# EAGLE design menial_board_v2 (EAGLE 5.10)
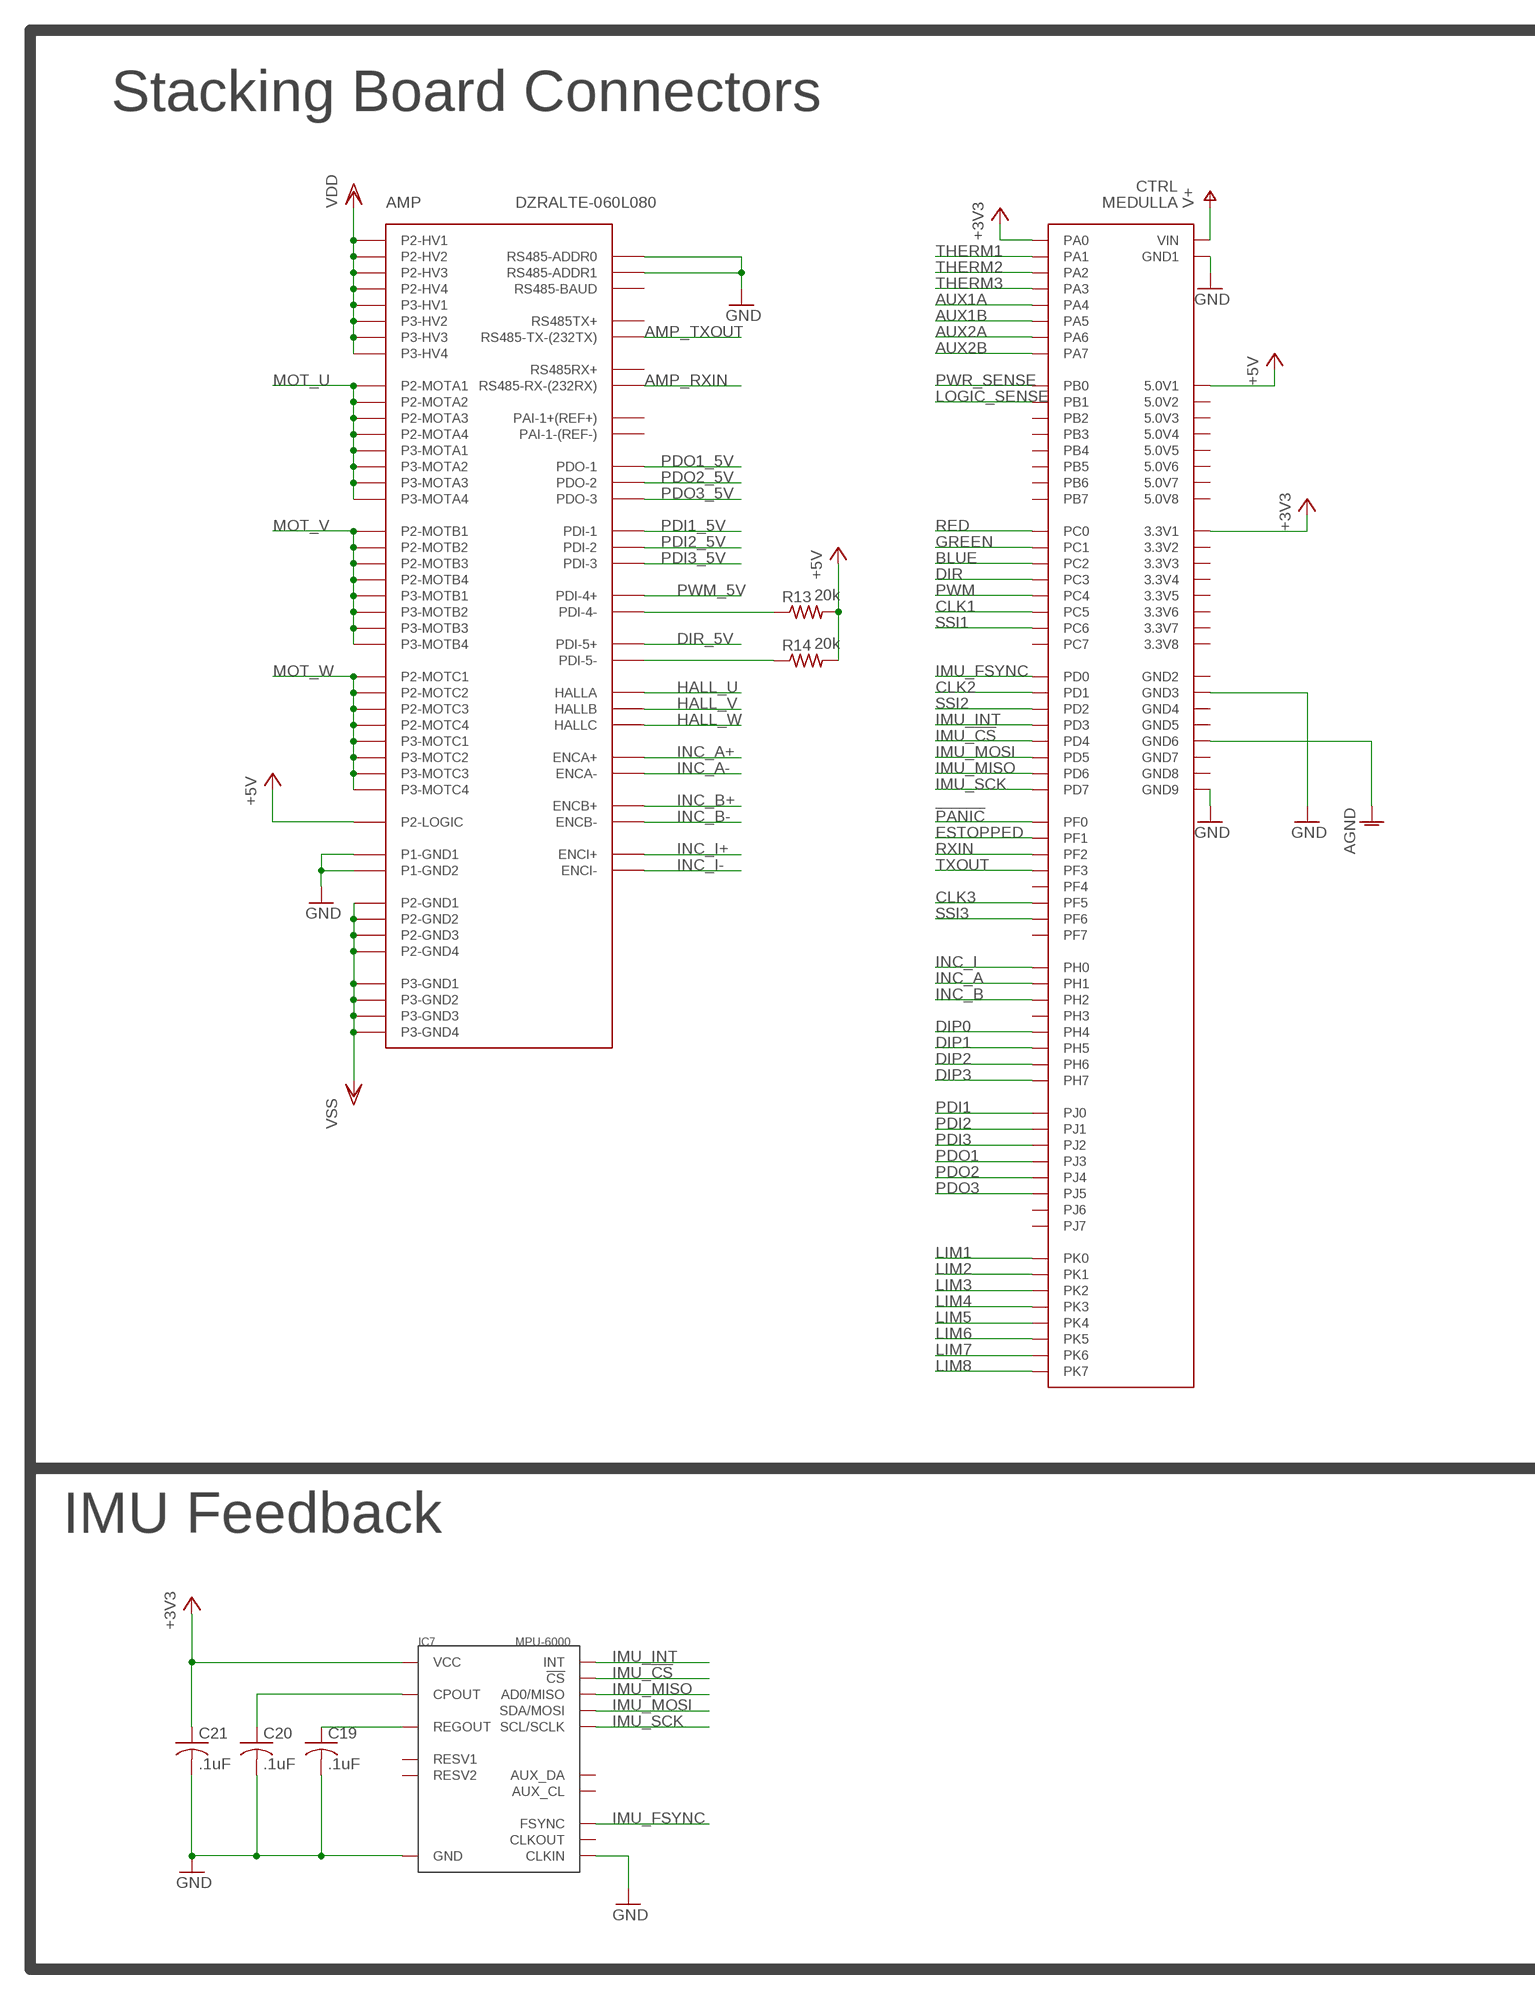
[diagram p0: schematic, sheet 1, part 1 of 2]
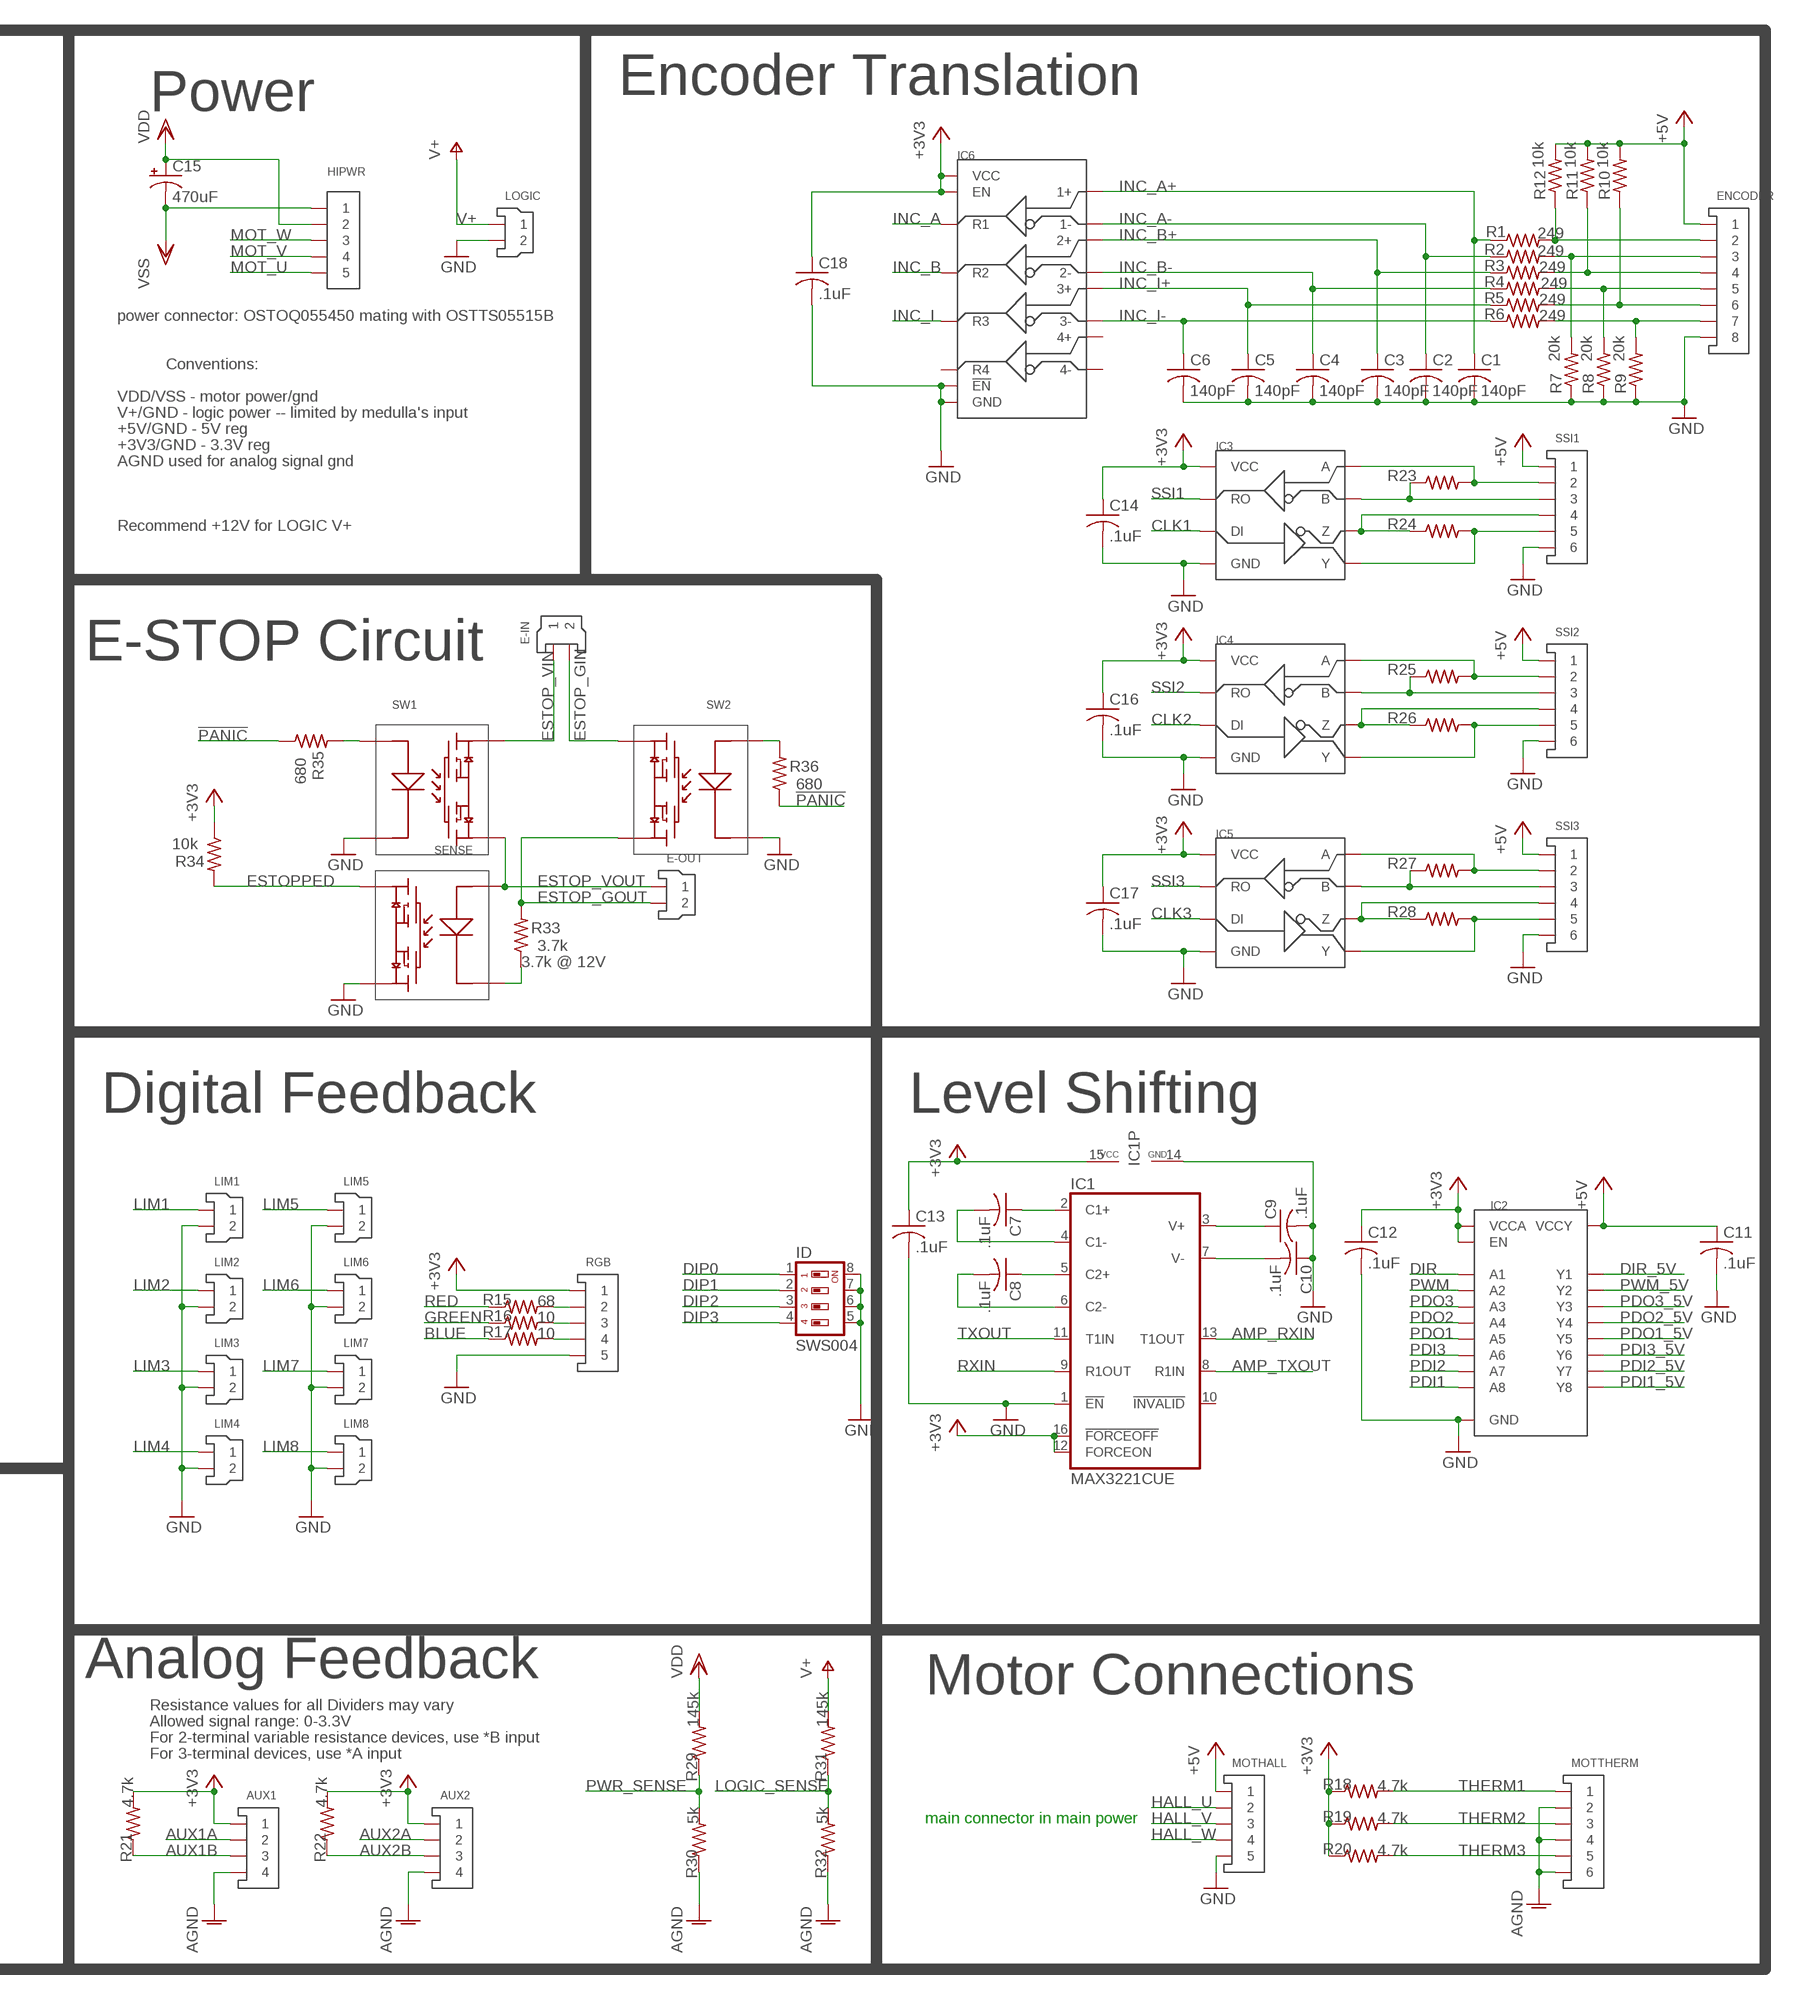
[diagram p1: schematic, sheet 1, part 2 of 2]

## Parts
AMP  DZRALTE-060L080  [DZRALTE-060L080]
AUX1  SHERLOCK-4POS  [SD-3562-04XX]
AUX2  SHERLOCK-4POS  [SD-3562-04XX]
C1  140pF  C-USC0603  [C0603]
C2  140pF  C-USC0603  [C0603]
C3  140pF  C-USC0603  [C0603]
C4  140pF  C-USC0603  [C0603]
C5  140pF  C-USC0603  [C0603]
C6  140pF  C-USC0603  [C0603]
C7  .1uF  C-USC0603  [C0603]
C8  .1uF  C-USC0603  [C0603]
C9  .1uF  C-USC0603  [C0603]
C10  .1uF  C-USC0603  [C0603]
C11  .1uF  C-USC0603  [C0603]
C12  .1uF  C-USC0603  [C0603]
C13  .1uF  C-USC0603  [C0603]
C14  .1uF  C-USC0603  [C0603]
C15  470uF  ECG-CAP  [ECG16X25]
C16  .1uF  C-USC0603  [C0603]
C17  .1uF  C-USC0603  [C0603]
C18  .1uF  C-USC0603  [C0603]
C19  .1uF  C-USC0603  [C0603]
C20  .1uF  C-USC0603  [C0603]
C21  .1uF  C-USC0603  [C0603]
CTRL  MEDULLA  [MEDULLA]
E-IN  SHERLOCK-2POS  [SD-3562-02XX]
E-OUT  SHERLOCK-2POS  [SD-3562-02XX]
ENCODER  SHERLOCK-8POS  [SD-3562-08XX]
HIPWR  OSTOQ055450  [OSTOQ055450]
IC1  MAX3221CUE  [TSSOP16]
IC2  ADG3308  [TSSOP20]
IC3  ADM3490  [SOIC08]
IC4  ADM3490  [SOIC08]
IC5  ADM3490  [SOIC08]
IC6  ADN4668  [TSSOP16]
IC7  MPU-6000  [QFN24]
ID  SWS004  [SMS-004]
LIM1  SHERLOCK-2POS  [SD-3562-02XX]
LIM2  SHERLOCK-2POS  [SD-3562-02XX]
LIM3  SHERLOCK-2POS  [SD-3562-02XX]
LIM4  SHERLOCK-2POS  [SD-3562-02XX]
LIM5  SHERLOCK-2POS  [SD-3562-02XX]
LIM6  SHERLOCK-2POS  [SD-3562-02XX]
LIM7  SHERLOCK-2POS  [SD-3562-02XX]
LIM8  SHERLOCK-2POS  [SD-3562-02XX]
LOGIC  SHERLOCK-2POS  [SD-3562-02XX]
MOTHALL  SHERLOCK-5POS  [SD-3562-05XX]
MOTTHERM  SHERLOCK-6POS  [SD-3562-06XX]
R1  249  R-US_R0603  [R0603]
R2  249  R-US_R0603  [R0603]
R3  249  R-US_R0603  [R0603]
R4  249  R-US_R0603  [R0603]
R5  249  R-US_R0603  [R0603]
R6  249  R-US_R0603  [R0603]
R7  20k  R-US_R0603  [R0603]
R8  20k  R-US_R0603  [R0603]
R9  20k  R-US_R0603  [R0603]
R10  10k  R-US_R0603  [R0603]
R11  10k  R-US_R0603  [R0603]
R12  10k  R-US_R0603  [R0603]
R13  20k  R-US_R0603  [R0603]
R14  20k  R-US_R0603  [R0603]
R15  68  R-US_R0603  [R0603]
R16  10  R-US_R0603  [R0603]
R17  10  R-US_R0603  [R0603]
R18  4.7k  R-US_R0603  [R0603]
R19  4.7k  R-US_R0603  [R0603]
R20  4.7k  R-US_R0603  [R0603]
R21  4.7k  R-US_R0603  [R0603]
R22  4.7k  R-US_R0603  [R0603]
R23  R-US_R0603  [R0603]
R24  R-US_R0603  [R0603]
R25  R-US_R0603  [R0603]
R26  R-US_R0603  [R0603]
R27  R-US_R0603  [R0603]
R28  R-US_R0603  [R0603]
R29  145k  R-US_R0603  [R0603]
R30  5k  R-US_R0603  [R0603]
R31  145k  R-US_R0603  [R0603]
R32  5k  R-US_R0603  [R0603]
R33  3.7k  R-US_R0603  [R0603]
R34  10k  R-US_R0603  [R0603]
R35  680  R-US_R0603  [R0603]
R36  680  R-US_R0603  [R0603]
RGB  SHERLOCK-5POS  [SD-3562-05XX]
SENSE  G3VM-61D1  [G3VM-61D1]
SSI1  SHERLOCK-6POS  [SD-3562-06XX]
SSI2  SHERLOCK-6POS  [SD-3562-06XX]
SSI3  SHERLOCK-6POS  [SD-3562-06XX]
SW1  G3VM-61D1  [G3VM-61D1]
SW2  G3VM-61D1  [G3VM-61D1]

## Nets
!PANIC: CTRL.PF0 R35.1 R36.1
+3V3: AUX1.P$1 AUX2.P$1 C12.1 C13.1 C14.1 C16.1 C17.1 C18.1 C21.1 CTRL.3.3V1 CTRL.PA0 IC1.12(FORCEON) IC1.15(VCC) IC1.16(!FORCEOFF) IC2.1(VCCA) IC2.10(EN) IC3.1(VCC) IC4.1(VCC) IC5.1(VCC) IC6.13(VCC) IC6.16(EN) IC7.P$13(VCC) R18.1 R19.1 R20.1 R21.2 R22.2 R34.1 RGB.P$1
+5V: AMP.P2-1A(P2-LOGIC) C11.1 CTRL.5.0V1 ENCODER.P$1 IC2.20(VCCY) MOTHALL.P$1 R10.2 R11.2 R12.2 R13.2 R14.2 SSI1.P$1 SSI2.P$1 SSI3.P$1
AGND: AUX1.P$4 AUX2.P$4 CTRL.GND6 MOTTHERM.P$2 MOTTHERM.P$4 MOTTHERM.P$6 R30.1 R32.1
AMP_RXIN: AMP.P13(RS485-RX-(232RX)) IC1.13(T1OUT)
AMP_TXOUT: AMP.P15(RS485-TX-(232TX)) IC1.8(R1IN)
AUX1A: AUX1.P$2 CTRL.PA4
AUX1B: AUX1.P$3 CTRL.PA5 R21.1
AUX2A: AUX2.P$2 CTRL.PA6
AUX2B: AUX2.P$3 CTRL.PA7 R22.1
BLUE: CTRL.PC2 R17.1
CLK1: CTRL.PC5 IC3.3(DI)
CLK2: CTRL.PD1 IC4.3(DI)
CLK3: CTRL.PF5 IC5.3(DI)
DIP0: CTRL.PH4 ID.1
DIP1: CTRL.PH5 ID.2
DIP2: CTRL.PH6 ID.3
DIP3: CTRL.PH7 ID.4
DIR: CTRL.PC3 IC2.2(A1)
DIR_5V: AMP.P19(PDI-5+) IC2.19(Y1)
ESTOP_GIN: E-IN.P$2 SW2.P$4
ESTOP_GOUT: E-OUT.P$2 R33.2 SW2.P$3
ESTOP_VIN: E-IN.P$1 SW1.P$4
ESTOP_VOUT: E-OUT.P$1 SENSE.P$1 SW1.P$3
ESTOPPED: CTRL.PF1 R34.2 SENSE.P$4
GND: AMP.P1(RS485-ADDR0) AMP.P2(RS485-ADDR1) AMP.P5(P1-GND1) AMP.P21(P1-GND2) C1.2 C2.2 C3.2 C4.2 C5.2 C6.2 C9.2 C10.1 C11.2 C12.2 C13.2 C14.2 C16.2 C17.2 C18.2 C19.2 C20.2 C21.2 CTRL.GND1 CTRL.GND3 CTRL.GND9'(GND9) ENCODER.P$8 IC1.1(!EN) IC1.14(GND) IC2.11(GND) IC3.4(GND) IC4.4(GND) IC5.4(GND) IC6.9(!EN) IC6.12(GND) IC7.P$1(CLKIN) IC7.P$18(GND) ID.5 ID.6 ID.7 ID.8 LIM1.P$2 LIM2.P$2 LIM3.P$2 LIM4.P$2 LIM5.P$2 LIM6.P$2 LIM7.P$2 LIM8.P$2 LOGIC.P$2 MOTHALL.P$5 R7.1 R8.1 R9.1 RGB.P$5 SENSE.P$3 SSI1.P$6 SSI2.P$6 SSI3.P$6 SW1.P$2 SW2.P$2
GREEN: CTRL.PC1 R16.1
HALL_U: AMP.P22(HALLA) MOTHALL.P$2
HALL_V: AMP.P23(HALLB) MOTHALL.P$3
HALL_W: AMP.P24(HALLC) MOTHALL.P$4
IMU_!CS: CTRL.PD4 IC7.P$8(!CS)
IMU_FSYNC: CTRL.PD0 IC7.P$11(FSYNC)
IMU_INT: CTRL.PD3 IC7.P$12(INT)
IMU_MISO: CTRL.PD6 IC7.P$9(AD0/MISO)
IMU_MOSI: CTRL.PD5 IC7.P$24(SDA/MOSI)
IMU_SCK: CTRL.PD7 IC7.P$23(SCL/SCLK)
INC_A: CTRL.PH1 IC6.15(R1)
INC_A+: AMP.P27(ENCA+) C1.1 IC6.2(1+) R1.1
INC_A-: AMP.P28(ENCA-) C2.1 IC6.1(1-) R2.1
INC_B: CTRL.PH2 IC6.14(R2)
INC_B+: AMP.P29(ENCB+) C3.1 IC6.3(2+) R3.1
INC_B-: AMP.P30(ENCB-) C4.1 IC6.4(2-) R4.1
INC_I: CTRL.PH0 IC6.11(R3)
INC_I+: AMP.P25(ENCI+) C5.1 IC6.6(3+) R5.1
INC_I-: AMP.P26(ENCI-) C6.1 IC6.5(3-) R6.1
LIM1: CTRL.PK0 LIM1.P$1
LIM2: CTRL.PK1 LIM2.P$1
LIM3: CTRL.PK2 LIM3.P$1
LIM4: CTRL.PK3 LIM4.P$1
LIM5: CTRL.PK4 LIM5.P$1
LIM6: CTRL.PK5 LIM6.P$1
LIM7: CTRL.PK6 LIM7.P$1
LIM8: CTRL.PK7 LIM8.P$1
LOGIC_SENSE: CTRL.PB1 R31.1 R32.2
MOT_U: AMP.P2-11A(P2-MOTA1) AMP.P2-11B(P2-MOTA2) AMP.P2-12A(P2-MOTA3) AMP.P2-12B(P2-MOTA4) AMP.P3-11A(P3-MOTA1) AMP.P3-11B(P3-MOTA2) AMP.P3-12A(P3-MOTA3) AMP.P3-12B(P3-MOTA4) HIPWR.P$5
MOT_V: AMP.P2-9A(P2-MOTB1) AMP.P2-9B(P2-MOTB2) AMP.P2-10A(P2-MOTB3) AMP.P2-10B(P2-MOTB4) AMP.P3-9A(P3-MOTB1) AMP.P3-9B(P3-MOTB2) AMP.P3-10A(P3-MOTB3) AMP.P3-10B(P3-MOTB4) HIPWR.P$4
MOT_W: AMP.P2-7A(P2-MOTC1) AMP.P2-7B(P2-MOTC2) AMP.P2-8A(P2-MOTC3) AMP.P2-8B(P2-MOTC4) AMP.P3-7A(P3-MOTC1) AMP.P3-7B(P3-MOTC2) AMP.P3-8A(P3-MOTC3) AMP.P3-8B(P3-MOTC4) HIPWR.P$3
N$1: ENCODER.P$2 R1.2 R12.1
N$2: R35.2 SW1.P$1
N$3: ENCODER.P$3 R2.2 R7.2
N$4: ENCODER.P$4 R3.2 R11.1
N$5: ENCODER.P$5 R4.2 R8.2
N$6: ENCODER.P$6 R5.2 R10.1
N$7: ENCODER.P$7 R6.2 R9.2
N$8: C7.2 IC1.4(C1-)
N$9: C7.1 IC1.2(C1+)
N$10: AMP.P20(PDI-5-) R14.1
N$11: AMP.P18(PDI-4-) R13.1
N$12: C8.2 IC1.6(C2-)
N$13: C8.1 IC1.5(C2+)
N$14: C9.1 IC1.3(V+)
N$15: C10.2 IC1.7(V-)
N$16: R17.2 RGB.P$4
N$17: R16.2 RGB.P$3
N$18: R15.2 RGB.P$2
N$19: IC3.8(A) R23.2 SSI1.P$2
N$20: R36.2 SW2.P$1
N$22: R33.1 SENSE.P$2
N$23: IC3.7(B) R23.1 SSI1.P$3
N$24: IC3.6(Z) R24.1 SSI1.P$4
N$25: IC3.5(Y) R24.2 SSI1.P$5
N$26: IC4.8(A) R25.2 SSI2.P$2
N$27: IC4.7(B) R25.1 SSI2.P$3
N$28: C19.1 IC7.P$10(REGOUT)
N$29: C20.1 IC7.P$20(CPOUT)
N$30: IC4.6(Z) R26.1 SSI2.P$4
N$31: IC4.5(Y) R26.2 SSI2.P$5
N$34: IC5.8(A) R27.2 SSI3.P$2
N$35: IC5.7(B) R27.1 SSI3.P$3
N$36: IC5.6(Z) R28.1 SSI3.P$4
N$37: IC5.5(Y) R28.2 SSI3.P$5
PDI1: CTRL.PJ0 IC2.9(A8)
PDI1_5V: AMP.P10(PDI-1) IC2.12(Y8)
PDI2: CTRL.PJ1 IC2.8(A7)
PDI2_5V: AMP.P11(PDI-2) IC2.13(Y7)
PDI3: CTRL.PJ2 IC2.7(A6)
PDI3_5V: AMP.P12(PDI-3) IC2.14(Y6)
PDO1: CTRL.PJ3 IC2.6(A5)
PDO1_5V: AMP.P7(PDO-1) IC2.15(Y5)
PDO2: CTRL.PJ4 IC2.5(A4)
PDO2_5V: AMP.P8(PDO-2) IC2.16(Y4)
PDO3: CTRL.PJ5 IC2.4(A3)
PDO3_5V: AMP.P9(PDO-3) IC2.17(Y3)
PWM: CTRL.PC4 IC2.3(A2)
PWM_5V: AMP.P17(PDI-4+) IC2.18(Y2)
PWR_SENSE: CTRL.PB0 R29.1 R30.2
RED: CTRL.PC0 R15.1
RXIN: CTRL.PF2 IC1.9(R1OUT)
SSI1: CTRL.PC6 IC3.2(RO)
SSI2: CTRL.PD2 IC4.2(RO)
SSI3: CTRL.PF6 IC5.2(RO)
THERM1: CTRL.PA1 MOTTHERM.P$1 R18.2
THERM2: CTRL.PA2 MOTTHERM.P$3 R19.2
THERM3: CTRL.PA3 MOTTHERM.P$5 R20.2
TXOUT: CTRL.PF3 IC1.11(T1IN)
V+: CTRL.P$1(VIN) LOGIC.P$1 R31.2
VDD: AMP.P2-4A(P2-HV1) AMP.P2-4B(P2-HV2) AMP.P2-5A(P2-HV3) AMP.P2-5B(P2-HV4) AMP.P3-4A(P3-HV1) AMP.P3-4B(P3-HV2) AMP.P3-5A(P3-HV3) AMP.P3-5B(P3-HV4) C15.P$1(+) HIPWR.P$2 R29.2
VSS: AMP.P2-2A(P2-GND1) AMP.P2-2B(P2-GND3) AMP.P2-3A(P2-GND2) AMP.P2-3B(P2-GND4) AMP.P3-2A(P3-GND1) AMP.P3-2B(P3-GND2) AMP.P3-3A(P3-GND3) AMP.P3-3B(P3-GND4) C15.P$2(-) HIPWR.P$1
Unconnected: AMP.P3(PAI-1+(REF+)) AMP.P4(PAI-1-(REF-)) AMP.P6(RS485-BAUD) AMP.P14(RS485RX+) AMP.P16(RS485TX+) CTRL.3.3V2 CTRL.3.3V3 CTRL.3.3V4 CTRL.3.3V5 CTRL.3.3V6 CTRL.3.3V7 CTRL.3.3V8 CTRL.5.0V2 CTRL.5.0V3 CTRL.5.0V4 CTRL.5.0V5 CTRL.5.0V6 CTRL.5.0V7 CTRL.5.0V8 CTRL.GND2 CTRL.GND4 CTRL.GND5 CTRL.GND7 CTRL.GND8 CTRL.PB2 CTRL.PB3 CTRL.PB4 CTRL.PB5 CTRL.PB6 CTRL.PB7 CTRL.PC7 CTRL.PF4 CTRL.PF7 CTRL.PH3 CTRL.PJ6 CTRL.PJ7 IC1.10(!INVALID) IC6.7(4+) IC6.8(4-) IC6.10(R4) IC7.P$6(AUX_DA) IC7.P$7(AUX_CL) IC7.P$19(RESV1) IC7.P$21(RESV2) IC7.P$22(CLKOUT)

## Notes on the sheet
- Stacking Board Connectors | Power | Encoder Translation
- power connector: OSTOQ055450 mating with OSTTS05515B
- Conventions:
- VDD/VSS - motor power/gnd
- V+/GND - logic power -- limited by medulla's input
- +5V/GND - 5V reg
- +3V3/GND - 3.3V reg
- AGND used for analog signal gnd
- Recommend +12V for LOGIC V+
- E-STOP Circuit
- 3.7k @ 12V
- Digital Feedback | Level Shifting
- IMU Feedback
- Analog Feedback | Motor Connections
- Resistance values for all Dividers may vary
- Allowed signal range: 0-3.3V
- For 2-terminal variable resistance devices, use *B input
- For 3-terminal devices, use *A input
- main connector in main power

## Library data of the parts
AMP = hurst:DZRALTE-060L080
AUX1 AUX2 = hurst:SHERLOCK-4POS
C1-C14 C16-C21 = rcl:C-US: CAPACITOR, American symbol
C15 = hurst:ECG-CAP
CTRL = hurst:MEDULLA
E-IN E-OUT LIM1-LIM8 LOGIC = hurst:SHERLOCK-2POS
ENCODER = hurst:SHERLOCK-8POS
HIPWR = hurst:OSTOQ055450
IC1 = maxim:MAX3221*: RS-232 Transceivers with AutoShutdown 1µA Supply-Current, True +3V to +5.5V http://dbserv.maxim-ic.com/
IC2 = hurst:ADG3308
IC3-IC5 = hurst:ADM3490
IC6 = hurst:ADN4668
IC7 = hurst:MPU-6000
ID = smd-special:SWS004: SMD Dip Switch 4 pol.
MOTHALL RGB = hurst:SHERLOCK-5POS
MOTTHERM SSI1-SSI3 = hurst:SHERLOCK-6POS
R1-R36 = rcl:R-US_: RESISTOR, American symbol
SENSE SW1 SW2 = hurst:G3VM-61D1

## Board
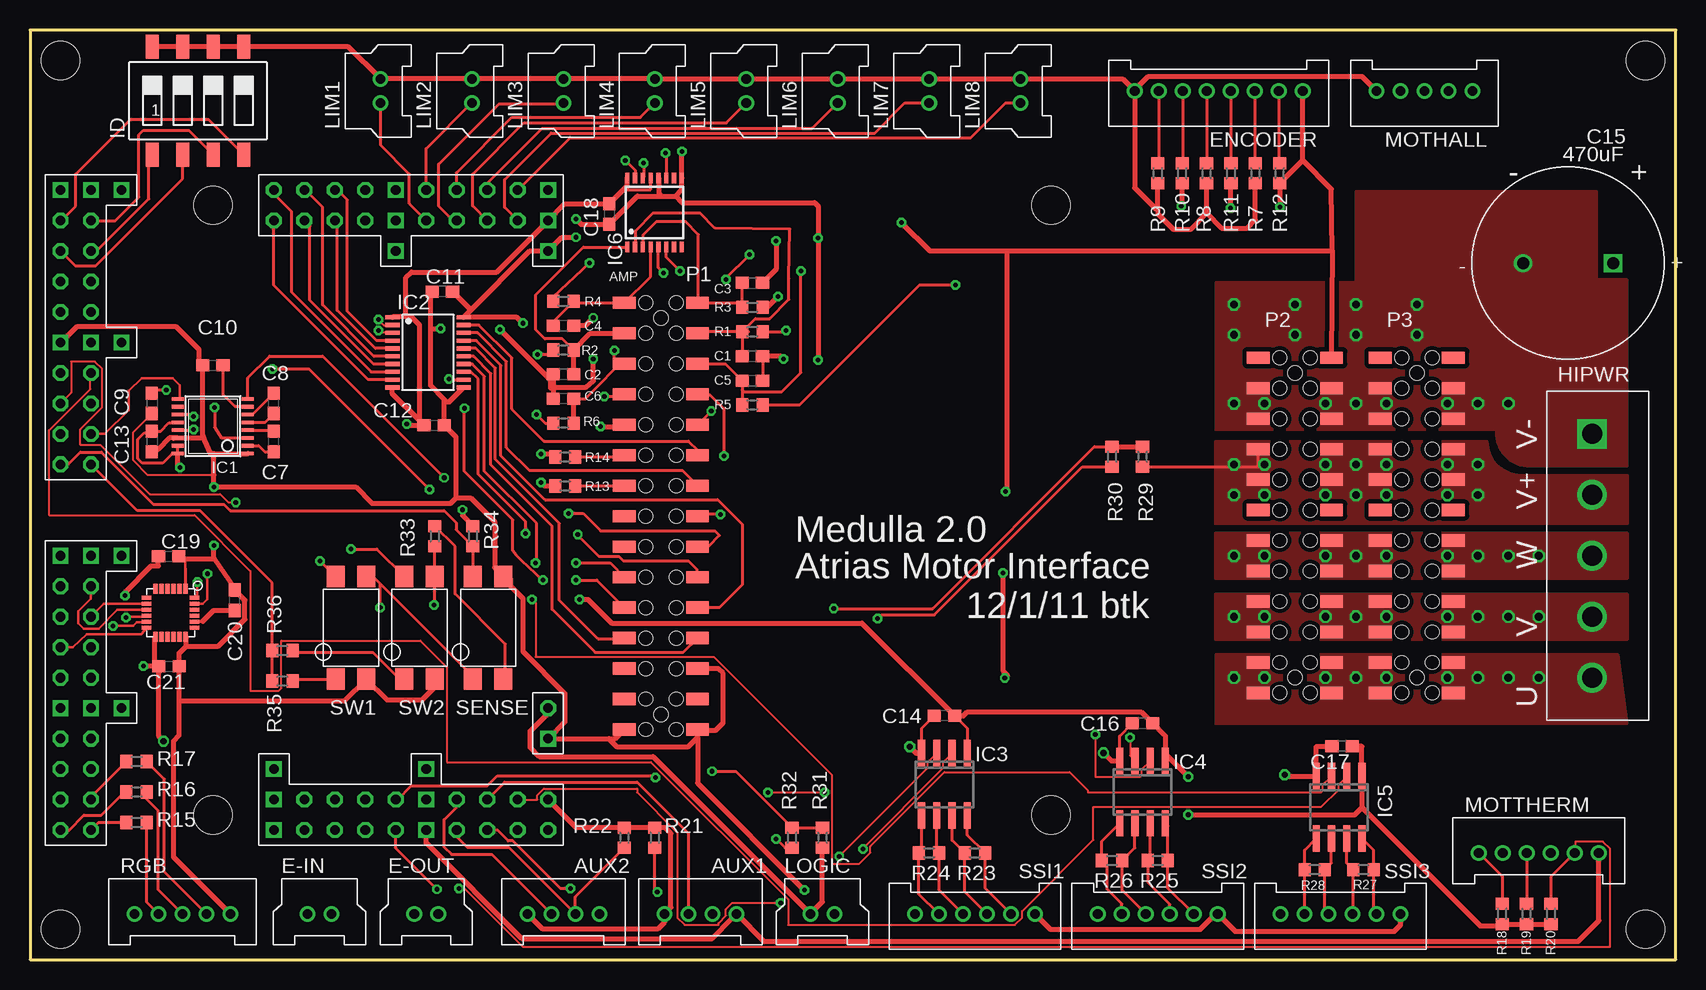
[diagram p2: board, top side]
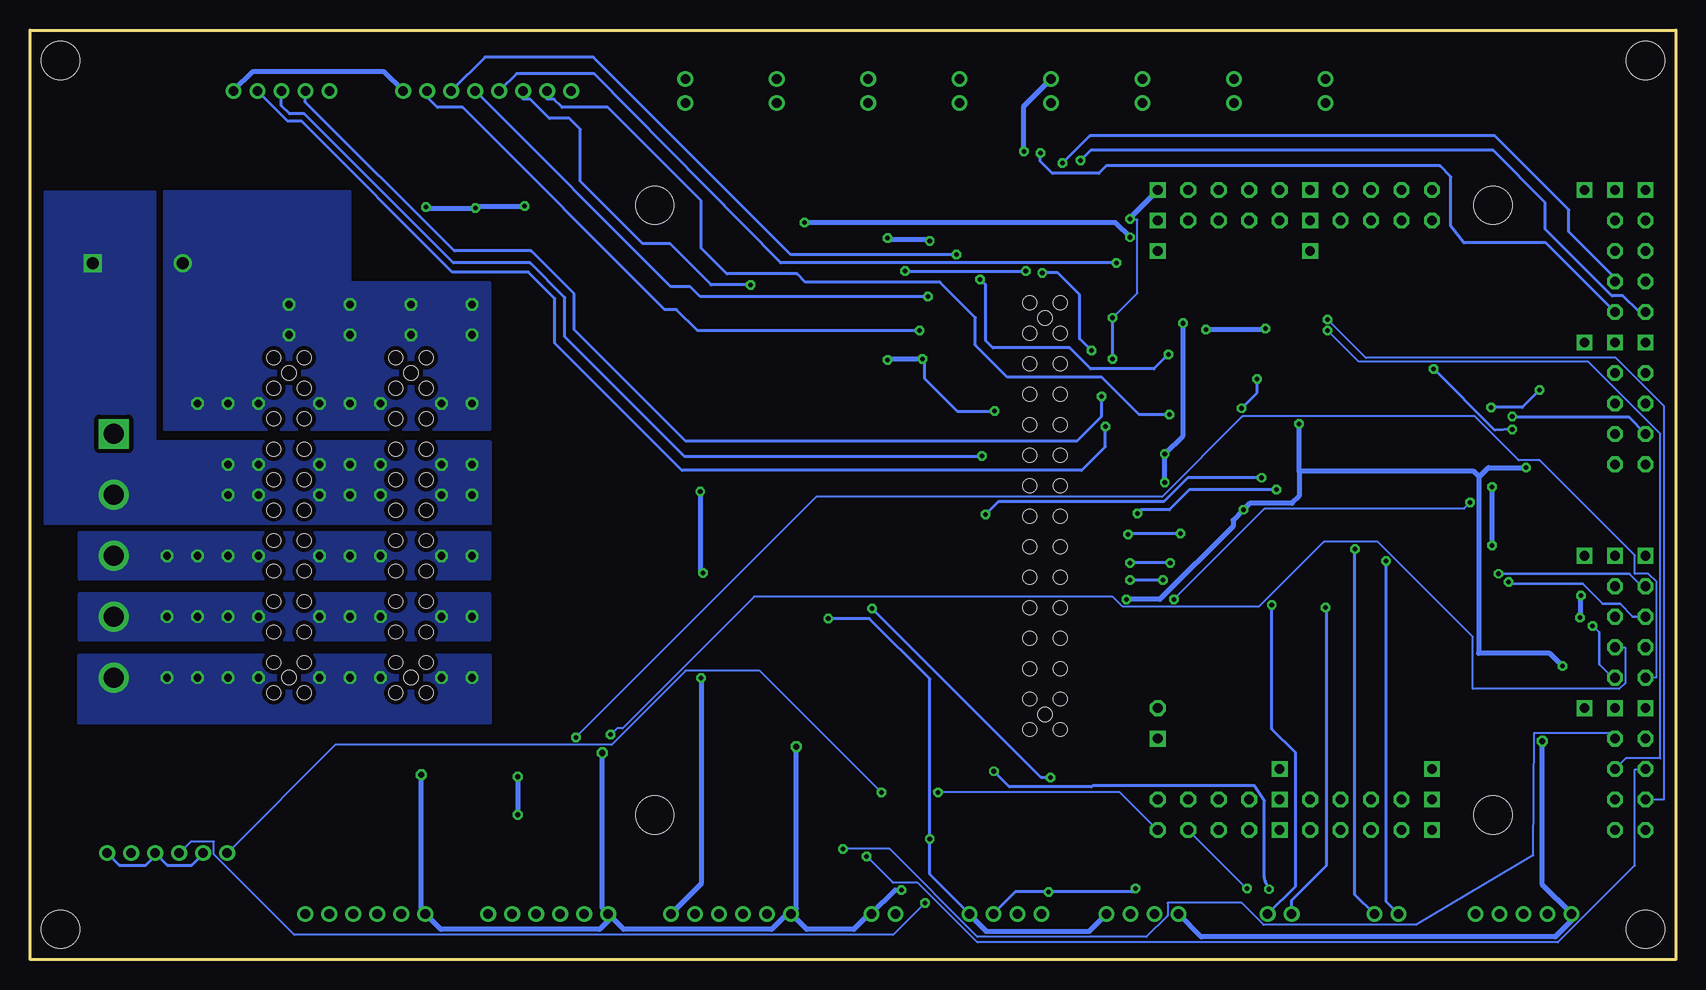
[diagram p3: board, bottom side, seen from below]

Size 137.16 x 77.47 mm. Coordinates in mm from the lower left corner, seen from the top.
Outline: 0,0 137.16,0 137.16,77.47 0,77.47 0,0
Copper layers (1*16): Top 0.035mm / dielectric 1.5mm / Bottom 0.035mm
Design rules "default *": minimum track width 7mil, minimum drill 15mil, track to track 5mil, track to pad 5mil, pad to pad 5mil, via to via 5mil, smd to smd 5mil, copper to edge 10mil, drill to drill 8mil, minimum pad ring 10mil, minimum via ring 8mil, stop-mask expansion 4mil, vias tented up to drill 0mil, thermal gap 10mil
Holes 3.17 mm at 2.54,74.93 2.54,2.54 134.62,2.54 134.62,74.93
tRestrict: area 0,0 to 5.1,5.1; area 132.1,0 to 137.2,5.1; area 132.1,72.4 to 137.2,77.5; area -0.3,72.1 to 5.4,77.8; area 12.7,60.3 to 17.8,65.4; area 12.7,9.5 to 17.8,14.6; area 81.9,8.8 to 88.3,15.3; area 81.9,59.7 to 88.3,66

### Footprints (pad centres in the part's own frame; a part is rotated, then mirrored left to right if it is on the bottom)
DZRALTE-060L080 = smd 1.905 x 1.016: P1 8.636,-44.958; P2 2.54,-44.958; P2-1A 61.468,-13.97; P2-1B 55.372,-13.97; P2-2A 61.468,-16.51; P2-2B 55.372,-16.51; P2-3A 61.468,-19.05; P2-3B 55.372,-19.05; P2-4A 61.468,-21.59; P2-4B 55.372,-21.59; P2-5A 61.468,-24.13; P2-5B 55.372,-24.13; P2-6A 61.468,-26.67; P2-6B 55.372,-26.67; P2-7A 61.468,-29.21; P2-7B 55.372,-29.21; P2-8A 61.468,-31.75; P2-8B 55.372,-31.75; P2-9A 61.468,-34.29; P2-9B 55.372,-34.29; P2-10A 61.468,-36.83; P2-10B 55.372,-36.83; P2-11A 61.468,-39.37; P2-11B 55.372,-39.37; P2-12A 61.468,-41.91; P2-12B 55.372,-41.91; P3 8.636,-42.418; P3-1A 71.628,-13.97; P3-1B 65.532,-13.97; P3-2A 71.628,-16.51; P3-2B 65.532,-16.51; P3-3A 71.628,-19.05; P3-3B 65.532,-19.05; P3-4A 71.628,-21.59; P3-4B 65.532,-21.59; P3-5A 71.628,-24.13; P3-5B 65.532,-24.13; P3-6A 71.628,-26.67; P3-6B 65.532,-26.67; P3-7A 71.628,-29.21; P3-7B 65.532,-29.21; P3-8A 71.628,-31.75; P3-8B 65.532,-31.75; P3-9A 71.628,-34.29; P3-9B 65.532,-34.29; P3-10A 71.628,-36.83; P3-10B 65.532,-36.83; P3-11A 71.628,-39.37; P3-11B 65.532,-39.37; P3-12A 71.628,-41.91; P3-12B 65.532,-41.91; P4 2.54,-42.418; P5 8.636,-39.878; P6 2.54,-39.878; P7 8.636,-37.338; P8 2.54,-37.338; P9 8.636,-34.798; P10 2.54,-34.798; P11 8.636,-32.258; P12 2.54,-32.258; P13 8.636,-29.718; P14 2.54,-29.718; P15 8.636,-27.178; P16 2.54,-27.178; P17 8.636,-24.638; P18 2.54,-24.638; P19 8.636,-22.098; P20 2.54,-22.098; P21 8.636,-19.558; P22 2.54,-19.558; P23 8.636,-17.018; P24 2.54,-17.018; P25 8.636,-14.478; P26 2.54,-14.478; P27 8.636,-11.938; P28 2.54,-11.938; P29 8.636,-9.398; P30 2.54,-9.398 | hole 1.143: 6.858,-44.958; 6.858,-42.418; 6.858,-39.878; 6.858,-37.338; 6.858,-34.798; 6.858,-32.258; 6.858,-29.718; 6.858,-27.178; 6.858,-24.638; 6.858,-22.098; 6.858,-19.558; 6.858,-17.018; 6.858,-14.478; 6.858,-11.938; 6.858,-9.398; 4.318,-9.398; 4.318,-11.938; 4.318,-14.478; 4.318,-17.018; 4.318,-19.558; 4.318,-22.098; 4.318,-24.638; 4.318,-27.178; 4.318,-29.718; 4.318,-32.258; 4.318,-34.798; 4.318,-37.338; 4.318,-39.878; 4.318,-42.418; 4.318,-44.958; 59.69,-41.91; 59.69,-39.37; 59.69,-36.83; 59.69,-34.29; 59.69,-31.75; 59.69,-29.21; 59.69,-26.67; 59.69,-24.13; 59.69,-21.59; 59.69,-19.05; 59.69,-16.51; 59.69,-13.97; 57.15,-13.97; 57.15,-16.51; 57.15,-19.05; 57.15,-21.59; 57.15,-24.13; 57.15,-26.67; 57.15,-29.21; 57.15,-31.75; 57.15,-34.29; 57.15,-36.83; 57.15,-39.37; 57.15,-41.91; 69.85,-41.91; 69.85,-39.37; 69.85,-36.83; 69.85,-34.29; 69.85,-31.75; 69.85,-29.21; 69.85,-26.67; 69.85,-24.13; 69.85,-21.59; 69.85,-19.05; 69.85,-16.51; 69.85,-13.97; 67.31,-13.97; 67.31,-16.51; 67.31,-19.05; 67.31,-21.59; 67.31,-24.13; 67.31,-26.67; 67.31,-29.21; 67.31,-31.75; 67.31,-34.29; 67.31,-36.83; 67.31,-39.37; 67.31,-41.91 | hole 1.194: 5.588,-43.688; 5.588,-10.668; 58.42,-40.64; 68.58,-40.64; 58.42,-15.24; 68.58,-15.24
SD-3562-04XX = drill 0.8 round: P$1 -3,0; P$2 -1,0; P$3 1,0; P$4 3,0
C0603 = smd 1.1 x 1: 1 -0.85,0; 2 0.85,0
ECG16X25 = drill 1 square: P$1 -3.75,0 | drill 1 round: P$2 3.75,0
MEDULLA = drill 0.8 pad 1.016 square: 3.3V1 45.72,5.08; 3.3V2 58.42,5.08; 3.3V3 83.82,2.54; 3.3V4 83.82,15.24; 3.3V5 83.82,33.02; 3.3V6 83.82,45.72; 3.3V7 68.58,53.34; 3.3V8 55.88,53.34; 5.0V1 45.72,7.62; 5.0V2 58.42,7.62; 5.0V3 81.28,2.54; 5.0V4 81.28,15.24; 5.0V5 81.28,33.02; 5.0V6 81.28,45.72; 5.0V7 68.58,50.8; 5.0V8 55.88,50.8; GND1 45.72,2.54; GND2 86.36,2.54; GND3 86.36,15.24; GND4 86.36,33.02; GND5 86.36,45.72; GND6 55.88,55.88; GND7 68.58,55.88; GND8 58.42,2.54; GND9' 45.72,48.26 | drill 0.8 pad 1.016 octagon: P$1 45.72,45.72; PA0 45.72,53.34; PA1 45.72,55.88; PA2 48.26,53.34; PA3 48.26,55.88; PA4 50.8,53.34; PA5 50.8,55.88; PA6 53.34,53.34; PA7 53.34,55.88; PB0 58.42,53.34; PB1 58.42,55.88; PB2 60.96,53.34; PB3 60.96,55.88; PB4 63.5,53.34; PB5 63.5,55.88; PB6 66.04,53.34; PB7 66.04,55.88; PC0 83.82,55.88; PC1 86.36,55.88; PC2 83.82,53.34; PC3 86.36,53.34; PC4 83.82,50.8; PC5 86.36,50.8; PC6 83.82,48.26; PC7 86.36,48.26; PD0 83.82,43.18; PD1 86.36,43.18; PD2 83.82,40.64; PD3 86.36,40.64; PD4 83.82,38.1; PD5 86.36,38.1; PD6 83.82,35.56; PD7 86.36,35.56; PF0 83.82,25.4; PF1 86.36,25.4; PF2 83.82,22.86; PF3 86.36,22.86; PF4 83.82,20.32; PF5 86.36,20.32; PF6 83.82,17.78; PF7 86.36,17.78; PH0 83.82,12.7; PH1 86.36,12.7; PH2 83.82,10.16; PH3 86.36,10.16; PH4 83.82,7.62; PH5 86.36,7.62; PH6 83.82,5.08; PH7 86.36,5.08; PJ0 68.58,5.08; PJ1 68.58,2.54; PJ2 66.04,5.08; PJ3 66.04,2.54; PJ4 63.5,5.08; PJ5 63.5,2.54; PJ6 60.96,5.08; PJ7 60.96,2.54; PK0 55.88,5.08; PK1 55.88,2.54; PK2 53.34,5.08; PK3 53.34,2.54; PK4 50.8,5.08; PK5 50.8,2.54; PK6 48.26,5.08; PK7 48.26,2.54 | hole 3.175: 3.81,54.61; 3.81,3.81; 73.66,3.81; 73.66,54.61
SD-3562-02XX = drill 0.8 round: P$1 -1,0; P$2 1,0
SD-3562-08XX = drill 0.8 round: P$1 -7,0; P$2 -5,0; P$3 -3,0; P$4 -1,0; P$5 1,0; P$6 3,0; P$7 5,0; P$8 7,0
OSTOQ055450 = drill 1.65 square: P$1 -10.16,0 | drill 1.65 round: P$2 -5.08,0; P$3 0,0; P$4 5.08,0; P$5 10.16,0
TSSOP16 = smd 0.305 x 0.991: 1 -2.275,-2.918; 2 -1.625,-2.918; 3 -0.975,-2.918; 4 -0.325,-2.918; 5 0.325,-2.918; 6 0.975,-2.918; 7 1.625,-2.918; 8 2.275,-2.918; 9 2.275,2.918; 10 1.625,2.918; 11 0.975,2.918; 12 0.325,2.918; 13 -0.325,2.918; 14 -0.975,2.918; 15 -1.625,2.918; 16 -2.275,2.918
TSSOP20 = smd 0.35 x 1.2: 1 -2.275,-2.97; 2 -1.625,-2.97; 3 -0.975,-2.97; 4 -0.325,-2.97; 5 0.325,-2.97; 6 0.975,-2.97; 7 1.625,-2.97; 8 2.275,-2.97; 9 2.925,-2.97; 10 3.575,-2.97; 11 3.575,2.97; 12 2.925,2.97; 13 2.275,2.97; 14 1.625,2.97; 15 0.975,2.97; 16 0.325,2.97; 17 -0.325,2.97; 18 -0.975,2.97; 19 -1.625,2.97; 20 -2.275,2.97
SOIC08 = smd 0.6 x 2.2: 1 -1.905,-2.6; 2 -0.635,-2.6; 3 0.635,-2.6; 4 1.905,-2.6; 5 1.905,2.6; 6 0.635,2.6; 7 -0.635,2.6; 8 -1.905,2.6
TSSOP16' = smd 0.9 x 0.35: 1 -2.875,2.275; 2 -2.875,1.625; 3 -2.875,0.975; 4 -2.875,0.325; 5 -2.875,-0.325; 6 -2.875,-0.975; 7 -2.875,-1.625; 8 -2.875,-2.275; 9 2.875,-2.275; 10 2.875,-1.625; 11 2.875,-0.975; 12 2.875,-0.325; 13 2.875,0.325; 14 2.875,0.975; 15 2.875,1.625; 16 2.875,2.275
QFN24 = smd 0.8 x 0.35: P$1 -2,1.25; P$2 -2,0.75; P$3 -2,0.25; P$4 -2,-0.25; P$5 -2,-0.75; P$6 -2,-1.25; P$13 2,-1.25; P$14 2,-0.75; P$15 2,-0.25; P$16 2,0.25; P$17 2,0.75; P$18 2,1.25 | smd 0.35 x 0.8: P$7 -1.25,-2; P$8 -0.75,-2; P$9 -0.25,-2; P$10 0.25,-2; P$11 0.75,-2; P$12 1.25,-2; P$19 1.25,2; P$20 0.75,2; P$21 0.25,2; P$22 -0.25,2; P$23 -0.75,2; P$24 -1.25,2
SMS-004 = smd 1.092 x 2.007: 1 -3.81,-4.496; 2 -1.27,-4.496; 3 1.27,-4.496; 4 3.81,-4.496; 5 3.81,4.496; 6 1.27,4.496; 7 -1.27,4.496; 8 -3.81,4.496
SD-3562-05XX = drill 0.8 round: P$1 -4,0; P$2 -2,0; P$3 0,0; P$4 2,0; P$5 4,0
SD-3562-06XX = drill 0.8 round: P$1 -5,0; P$2 -3,0; P$3 -1,0; P$4 1,0; P$5 3,0; P$6 5,0
R0603 = smd 1 x 1.1: 1 -0.85,0; 2 0.85,0
G3VM-61D1 = smd 1.5 x 1.8: P$1 -1.27,-4.275; P$2 1.27,-4.275; P$3 1.27,4.275; P$4 -1.27,4.275

### Placement (x,y rotation side)
AMP  46.99,64.14 0 top
AUX1  55.88,3.81 0 top
AUX2  44.45,3.81 0 top
C1  60.2,50.29 0 top
C2  44.45,48.77 180 top
C3  60.2,56.39 0 top
C4  44.45,52.83 0 top
C5  60.2,48.26 0 top
C6  44.45,46.74 180 top
C7  20.32,43.18 90 top
C8  20.32,46.35 90 top
C9  10.16,46.35 270 top
C10  15.24,49.53 0 top
C11  34.37,55.68 180 top
C12  33.68,44.53 0 top
C13  10.16,43.18 270 top
C14  76.2,20.32 180 top
C15  128.17,58.04 180 top
C16  92.71,19.68 180 top
C17  109.35,17.78 180 top
C18  48.26,62.13 270 top
C19  11.56,33.6 0 top
C20  17.07,29.95 90 top
C21  11.58,24.43 0 top
CTRL  88.9,66.67 180 top
E-IN  24.13,3.81 0 top
E-OUT  33.02,3.81 0 top
ENCODER  99.06,72.39 180 top
HIPWR  130.18,33.66 270 top
IC1  15.24,44.45 90 top
IC2  33.17,51.26 270 top
IC3  76.2,14.61 180 top
IC4  92.71,13.97 180 top
IC5  109.09,12.7 180 top
IC6  ADN4668  [TSSOP16']  52.04,62.26 90 top
IC7  11.71,28.91 270 top
ID  14,71.58 0 top
LIM1  29.21,72.39 90 top
LIM2  36.83,72.39 90 top
LIM3  44.45,72.39 90 top
LIM4  52.07,72.39 90 top
LIM5  59.69,72.39 90 top
LIM6  67.31,72.39 90 top
LIM7  74.93,72.39 90 top
LIM8  82.55,72.39 90 top
LOGIC  66.04,3.81 0 top
MOTHALL  116.2,72.39 180 top
MOTTHERM  125.73,8.89 0 top
R1  60.2,52.32 0 top
R2  44.45,50.8 180 top
R3  60.2,54.36 0 top
R4  44.45,54.86 180 top
R5  60.2,46.23 0 top
R6  44.45,44.7 180 top
R7  102.11,65.53 90 top
R8  98.04,65.53 90 top
R9  93.98,65.53 90 top
R10  96.01,65.53 270 top
R11  100.08,65.53 270 top
R12  104.14,65.53 270 top
R13  44.6,39.47 180 top
R14  44.6,41.88 180 top
R15  8.89,11.43 0 top
R16  8.89,13.97 0 top
R17  8.89,16.51 0 top
R18  122.68,3.81 90 top
R19  124.71,3.81 90 top
R20  126.75,3.81 90 top
R21  52.07,10.16 90 top
R22  49.53,10.16 90 top
R23  78.74,8.89 0 top
R24  74.93,8.89 180 top
R25  93.98,8.26 0 top
R26  90.17,8.26 180 top
R27  111.12,7.49 0 top
R28  107.06,7.49 180 top
R29  92.71,41.91 270 top
R30  90.17,41.91 90 top
R31  66.04,10.16 270 top
R32  63.5,10.16 90 top
R33  33.73,35.28 270 top
R34  36.91,35.28 270 top
R35  21.03,23.22 0 top
R36  21.03,25.76 0 top
RGB  12.7,3.81 0 top
SENSE  38.18,27.66 0 top
SSI1  78.74,3.81 180 top
SSI2  93.98,3.81 180 top
SSI3  109.22,3.81 180 top
SW1  26.75,27.66 0 top
SW2  32.46,27.66 0 top

### Tracks (layer width: path | path; a pad name or v marks a point on that pad's centre or on a via)
!PANIC
  Top 0.254: R35.1 R36.1 20.18,31.41 14.17,37.41 8.94,37.41 CTRL.PF0
+3V3  (via drill 0.38, 0.41, 0.51)
  Top 0.203: IC7.P$13 10.46,24.2 10.73,23.93
  Top 0.254: 122.68,2.82 R18.1 | 111.02,15.28 IC5.1 | 94.49,18.75 94.61,18.63 | IC3.1 78.11,19.27 C14.1 | IC1.12 12.28,44.73 11.58,44.73 10.88,44.03 C13.1 10.02,43.89 9.53,43.89 8.99,43.36 8.99,41.76 9.37,41.38 11.05,41.38 11.85,42.17 IC1.16 IC1.15 | IC6.13 51.72,64.16 49.77,64.16 49.77,64.49 | IC7.P$13 10.36,26.81
  Top 0.406: IC5.1 111,17.78 C17.1 | R20.1 R19.1 R18.1 | 122.68,2.82 120.85,2.82 111.02,12.65 111.02,12.7 | 111.02,12.7 111.02,15.28 | 94.61,17.14 IC4.1 | 94.49,18.75 C16.1 92.59,20.65 78.11,20.65 77.78,20.32 C14.1 69.33,28.04 48.46,28.04 46.48,30.02 v45.8,30.02 | v11.12,18.21 10.73,18.61 10.73,23.93 C21.1 | 32.47,44.89 C12.1 31.52,44.53 v31.39,44.65 | 32.47,44.89 30.2,47.15 IC2.10 | IC2.1 30.24,53.57 31.32,53.57 | 31.32,53.57 31.77,53.57 32.47,52.88 32.47,44.89 | 31.32,53.57 31.32,56.84 31.77,57.3 38.89,57.3 CTRL.3.3V1 44.56,62.98 C18.1 49.77,64.49 IC6.16 | R34.1 36.04,36.99 v36.04,37.49 | 10.36,26.81 10.36,24.46 v9.45,24.46 | v12.5,41 12.32,41.17 IC1.16 | CTRL.PA0 45.51,11.01 R22.2 R21.2 52.92,11.01 53.42,10.52 53.42,4.35 AUX1.P$1 52.88,3.12 52.35,2.59 42.67,2.59 AUX2.P$1 | 94.61,18.63 94.61,17.14 | 94.61,17.14 v96.52,15.24 | v96.52,12.06 110.39,12.06 111.02,12.7
  Bottom 0.406: v11.12,18.21 11.12,6.24 RGB.P$1 8.7,3.26 10.06,1.91 39.55,1.91 AUX2.P$1 | 31.39,40.69 31.39,38.63 32,38.02 35.51,38.02 v36.04,37.49 36.91,36.63 R34.1 43.01,30.02 v45.8,30.02 | 31.39,40.69 v31.39,44.65 | v9.45,24.46 10.52,25.53 16.46,25.53 16.38,25.6 16.38,40.23 | 16.38,40.23 15.62,41 v12.5,41 | 16.38,40.23 16.84,40.69 31.39,40.69 | v96.52,15.24 v96.52,12.06
+5V  (via drill 0.38)
  Top 0.254: 98.83,3.81 SSI2.P$1
  Top 0.406: SSI3.P$1 114.22,2.89 113.69,2.36 100.43,2.36 SSI2.P$1 | 98.83,3.81 97.54,2.52 85.03,2.52 SSI1.P$1 | R11.2 100.08,62.66 v100.05,62.64 | v104.17,62.71 104.17,64.66 R12.2 106.06,66.6 | R10.2 96.01,62.87 v95.94,62.79 | 106.06,66.6 ENCODER.P$1 | 108.53,59.05 AMP.P2-1A | 108.53,59.05 108.46,64.2 106.06,66.6 | v45.49,60.2 44.32,60.2 CTRL.5.0V1 41.66,59.05 36.64,54.03 | v72.62,61.42 74.98,59.05 81.38,59.05 | 81.38,59.05 108.53,59.05 | v81.23,23.47 81.46,23.7 81.08,24.08 v81.08,32.23 | 36.64,54.03 IC2.20 40.58,53.53 v41.07,53.03 | C11.1 36.64,54.25 36.64,54.03 | R13.2 42.9,39.47 v42.6,39.78 | v42.6,42.14 43.5,42.14 R14.2 | v81.31,39.01 81.38,39.09 81.38,59.05
  Top 0.61: AMP.P2-1A 108.58,50.16
  Bottom 0.406: v104.17,62.71 104.09,62.64 v100.05,62.64 99.9,62.79 v95.94,62.79 | MOTHALL.P$1 118.61,73.99 107.66,73.99 ENCODER.P$1 | v45.49,60.2 46.71,61.42 v72.62,61.42 | SSI1.P$1 81.23,6.32 v81.23,23.47 | v42.6,39.78 v42.6,42.14 41.07,43.66 v41.07,53.03 | v81.08,32.23 81.31,32.46 v81.31,39.01
AGND  (via drill 0.38)
  Top 0.254: R30.1 87.69,41.06 75.36,28.73 70.94,28.73 v70.64,28.42 | v62.18,10.06 62.93,9.31 R32.1
  Top 0.406: CTRL.GND6 33.02,9.73 41,1.75 56.84,1.75 58.52,3.43 58.52,3.45 AUX1.P$4 61.17,1.52 129.01,1.52 130.73,3.25 MOTTHERM.P$6
  Bottom 0.254: MOTTHERM.P$2 122.73,8.84 123.7,7.87 125.71,7.87 MOTTHERM.P$4 126.73,8.65 127.51,7.87 129.71,7.87 MOTTHERM.P$6 | v70.64,28.42 67.21,28.42 62.18,23.39 v62.18,10.06 62.18,7.11 AUX1.P$4
  Bottom 0.406: AUX2.P$4 48.9,2.36 57.45,2.36 58.88,3.79 AUX1.P$4
AMP_RXIN  (via drill 0.38)
  Top 0.254: AMP.P13 56.52,34.42 57.45,35.36 57.07,35.74 47.55,35.74 46.1,37.19 v44.88,37.19 | v33.3,39.17 23.24,49.23 v20.19,49.23 | v13.64,44.2 13.63,44.12 IC1.13
  Bottom 0.254: v44.88,37.19 44.58,37.49 42.22,37.49 40.54,39.17 v33.3,39.17 | v20.19,49.23 15.09,44.12 v13.64,44.2
AMP_TXOUT  (via drill 0.38)
  Top 0.254: IC1.8 18.16,48.48 19.96,50.29 24.38,50.29 v34.52,40.16 | v57.53,37.11 55.78,37.11 AMP.P15
  Bottom 0.254: v34.52,40.16 40.69,40.16 42.67,38.18 56.46,38.18 v57.53,37.11
AUX1A
  Top 0.254: CTRL.PA4 39.55,14.78 50.6,14.78 54.86,10.52 54.86,3.83 AUX1.P$2
AUX1B  (via drill 0.38)
  Top 0.254: v52.27,5.64 52.07,5.84 R21.1 | CTRL.PA5 38.96,10.79 39.85,9.91 40.23,9.91 44.2,5.94 v45.03,5.94
  Bottom 0.254: AUX1.P$3 55.05,5.64 v52.27,5.64 45.34,5.64 v45.03,5.94
AUX2A
  Top 0.254: AUX2.P$2 38.5,8.76 35.13,8.76 34.52,9.37 34.52,11.66 35.56,12.7 CTRL.PA6
AUX2B
  Top 0.254: CTRL.PA7 35.56,10.24 36.42,9.37 39.89,9.37 AUX2.P$3 45.45,5.23 R22.1
BLUE
  Top 0.254: CTRL.PC2 5.08,13.55 R17.1
CLK1  (via drill 0.38)
  Top 0.178: v67.44,8.61 74.83,16 74.83,16.46 75.51,17.14 IC3.3
  Bottom 0.178: v67.44,8.61 65.23,6.4 63.17,6.4 58.22,1.45 9.83,1.45 3.43,7.85 3.43,15.85 2.59,15.85 CTRL.PC5
CLK2  (via drill 0.38)
  Top 0.178: v91.67,18.52 91.67,16.99 92.05,16.61 IC4.3
  Bottom 0.178: v91.67,18.52 71.63,38.56 42.82,38.56 36.12,45.26 16.76,45.26 13.11,41.6 11.35,41.6 3.43,33.68 3.43,32.16 2.29,32.16 1.6,31.47 1.6,23.55 2.52,23.55 CTRL.PD1
CLK3  (via drill 0.38)
  Top 0.178: v41.83,30.02 42.14,29.72 42.14,25.22 57,25.22 66.83,15.39 66.83,8 69.11,8 70.03,8.91 70.03,9.45 76.2,15.62 86.64,15.62 88.16,14.1 88.16,13.95 107.59,13.95 107.75,14.1 107.75,14.55 108.43,15.24 IC5.3 | v17.14,38.1 16.54,38.1 15.85,38.79 9.98,38.79 5.87,42.9 4.19,42.9 4.19,44.2 6.02,46.02 6.02,49.23 5.41,49.84 3.43,49.84 3.43,47.24 CTRL.PF5
  Bottom 0.178: v41.83,30.02 34.29,37.57 17.68,37.57 v17.14,38.1
DIP0
  Top 0.254: ID.1 9.91,66.8 9.91,63.4 5.56,59.05 CTRL.PH4
DIP1
  Top 0.254: ID.2 12.72,65.08 5.49,57.84 3.76,57.84 CTRL.PH5
DIP2
  Top 0.254: CTRL.PH6 7.11,61.59 9.07,63.55 9.07,68.73 9.45,69.11 13.23,69.11 ID.3
DIP3
  Top 0.254: CTRL.PH7 2.62,61.59 3.81,62.79 3.81,65.46 8.38,70.03 14.86,70.03 ID.4
DIR  (via drill 0.38)
  Top 0.178: v29.03,53.34 29.49,52.88 30.18,52.88 IC2.2
  Bottom 0.178: v29.03,53.34 25.83,50.14 5.03,50.14 0.99,46.1 0.99,13.34 CTRL.PC3
DIR_5V
  Top 0.254: AMP.P19 55.63,42.44 54.86,43.2 42.82,43.2 40.16,45.87 40.16,50.14 37.41,52.88 IC2.19
ESTOP_GIN  (via drill 0.38)
  Top 0.254: v26.75,34.21 28.91,34.21 SW2.P$4
  Bottom 0.254: E-IN.P$2 26.75,5.43 v26.75,34.21
ESTOP_GOUT  (via drill 0.38)
  Top 0.203: SW2.P$3 33.73,32.21 33.83,32.31 33.6,32.31 33.53,32.23
  Top 0.254: R33.2 SW2.P$3 33.73,29.62 v33.68,29.57
  Bottom 0.254: E-OUT.P$2 31.7,6.13 31.7,17.22 33.68,19.2 v33.68,29.57
ESTOP_VIN  (via drill 0.38)
  Top 0.254: v24.16,33.22 25.44,31.94 SW1.P$4
  Bottom 0.254: E-IN.P$1 24.16,4.83 v24.16,33.22
ESTOP_VOUT  (via drill 0.38)
  Top 0.203: 36.91,23.6 SENSE.P$1
  Top 0.254: 29.18,31.32 36.91,23.6 | SW1.P$3 28.57,31.94 29.18,31.32 | SENSE.P$1 36.73,23.56 36.73,23.85 36.88,23.7 36.88,23.55 | v29.18,29.34 29.18,31.32
  Bottom 0.254: E-OUT.P$1 32.02,4.94 29.11,7.85 29.11,29.26 v29.18,29.34
ESTOPPED
  Top 0.254: CTRL.PF1 3.17,41.27 4.19,42.29 5.94,42.29 10.29,37.95 16.15,37.95 16.69,37.41 34.52,37.41 35.51,36.42 35.51,35.83 R34.2 SENSE.P$4
GND  (via drill 0.38, 0.51)
  Top 0.178: C9.2 10.13,45.49 8.61,43.97 8.61,41.6 9.83,40.39 15.32,40.39
  Top 0.203: IC7.P$1 | 12.95,33.38 12.95,32.61 | 12.26,33.54 C19.2 | C20.2 17.07,30.94 | 13.03,26.83 IC7.P$18
  Top 0.254: v104.55,15.39 104.64,15.3 | IC4.4 90.81,18.63 C16.2 | C14.2 74.3,19.27 IC3.4 | 12.95,32.61 IC7.P$1 | 33.73,22.68 SW2.P$2 | 11.98,43.43 IC1.14 | 10.67,42.52 10.35,42.52 C13.2 | C1.2 C5.2 | 43.51,47.7 43.36,47.62 43.36,48.53 | v56.77,45.72 AMP.P21
  Top 0.406: C17.2 107.19,17.78 IC5.4 104.64,15.3 | v89.46,17.22 90.11,16.57 IC4.4 | v73.3,17.75 73.85,17.2 IC3.4 | RGB.P$5 11.96,8.55 11.96,18.21 12.43,18.68 12.43,21.49 | 12.43,21.49 C21.2 12.43,25.54 13.03,26.14 | 17.07,30.94 15.39,33.38 | 15.39,33.38 12.95,33.38 12.26,33.54 | 13.03,26.14 13.03,26.83 | C20.2 17.91,29.96 17.91,28.35 15.7,26.14 13.03,26.14 | 33.73,22.68 32.69,21.64 29.76,21.64 SW1.P$2 26.2,21.57 12.51,21.57 arc90 12.43,21.49 | 48.23,18.41 CTRL.GND9' 44.58,19.81 44.58,22.17 41.07,25.68 41.07,30.1 40.01,31.17 40.01,31.77 39.84,31.94 SENSE.P$3 38.71,32.67 38.71,36.5 36.73,38.48 35.51,38.48 | 48.23,18.41 48.77,18.41 AMP.P2 | 55.63,18.52 AMP.P1 55.68,19.13 57.15,19.13 57.76,19.74 57.76,23.85 57.35,24.26 AMP.P5 | 55.63,18.52 54.86,17.75 48.9,17.75 48.23,18.41 | 55.63,18.52 55.63,14.71 v64.54,5.79 | 14.4,43.66 14.48,43.43 11.98,43.43 | 14.4,43.66 14.39,44.64 C10.1 14.1,49.82 14.1,50.83 12.19,52.73 3.89,52.73 2.59,51.44 CTRL.GND3 | IC1.14 11.62,43.48 10.67,42.52 | 15.32,42.17 15.05,42.17 14.4,43.66 | 15.32,42.17 IC1.1 | ID.8 ID.7 ID.6 ID.5 26.53,76.07 LIM1.P$2 LIM2.P$2 LIM3.P$2 LIM4.P$2 LIM5.P$2 LIM6.P$2 LIM7.P$2 LIM8.P$2 91.06,73.39 ENCODER.P$8 | 93.98,62.56 93.98,62.15 95.25,60.88 96.77,60.88 98.07,62.18 | 93.98,62.56 R9.1 | 98.07,62.18 98.07,64.66 R8.1 | R7.1 102.11,61.65 101.42,60.96 99.29,60.96 98.07,62.18 | MOTHALL.P$5 110.99,73.61 93.19,73.61 92.06,72.48 ENCODER.P$8 | C4.2 46.28,52.83 v46.94,53.49 | v46.94,50.06 46.94,48.23 46.33,47.7 43.51,47.7 | 43.36,48.53 C2.2 C6.2 | IC6.12 52.43,65.07 52.43,63.86 52.65,63.63 | 52.65,63.63 53.8,63.63 | 53.8,63.63 54.32,64.15 IC6.9 v54.32,67.35 v54.33,67.36
  Top 0.406: 53.8,63.63 54.33,63.09 65.38,63.09 65.68,62.79 v65.68,60.12 v65.68,49.99 | v62.79,50.06 62.56,50.29 C1.2 | C3.2 62.18,57.52 v62.18,59.89 | C11.2 33.38,55.54 33.38,52.5 | 33.38,52.5 33.38,47.85 34.53,46.7 34.53,46.48 | 34.53,46.48 C12.2 35.51,43.55 35.51,38.48 | IC2.11 34.94,46.48 34.53,46.48 | v45.49,61.72 45.94,61.28 C18.2 50.61,63.63 52.65,63.63 | 43.36,47.62 43.36,48.31 v39.17,52.5 | v34.21,52.58 33.45,52.58 33.38,52.5 | 15.39,33.38 15.32,33.45 v15.32,34.52 | 15.32,42.17 15.32,40.39 v15.32,39.4 27.13,39.4 28.5,38.02 35.05,38.02 35.51,38.48 | ENCODER.P$8 92.05,64.31 93.8,62.56 93.98,62.56
  Bottom 0.178: v46.94,53.49 44.88,55.55 44.88,61.65 45.34,61.65 v45.49,61.72
  Bottom 0.254: SSI2.P$6 88.98,3.22 | SSI1.P$6 74.07,3.81 | LOGIC.P$2 67.21,3.81 | v46.94,50.06 v46.94,53.49 | v56.77,45.72 59.89,45.72 62.64,48.46 62.64,49.91 v62.79,50.06
  Bottom 0.406: v104.55,15.39 104.55,4.14 SSI3.P$6 102.92,2.52 89.69,2.52 88.98,3.22 | 74.07,3.81 75.36,2.52 87.69,2.52 SSI2.P$6 89.46,4.29 v89.46,17.22 | 67.21,3.81 68.5,2.52 72.44,2.52 SSI1.P$6 73.3,4.25 v73.3,17.75 | v64.54,5.79 65.06,5.79 LOGIC.P$2 | v65.68,49.99 65.61,50.06 v62.79,50.06 | v62.18,59.89 62.33,60.05 65.68,60.05 | 65.68,60.05 65.68,59.97 | v65.68,60.12 65.68,60.05 | CTRL.GND1 45.49,61.82 v45.49,61.72 | LIM4.P$2 54.33,71.13 v54.33,67.36 | v39.17,52.5 34.29,52.5 v34.21,52.58 | v15.32,34.52 v15.32,39.4
GREEN
  Top 0.254: CTRL.PC1 3.25,10.79 4.5,12.04 5.94,12.04 7.54,13.64 7.71,13.64 R16.1
HALL_U  (via drill 0.38)
  Top 0.406: AMP.P22 49.38,44.42 v47.55,44.42
  Bottom 0.254: v47.55,44.42 47.55,42.75 49.53,40.77 82.83,40.77 93.42,51.36 93.42,55.09 95.63,57.3 101.96,57.3 114.53,69.88 115.69,69.88 MOTHALL.P$2
HALL_V  (via drill 0.38)
  Top 0.254: 55.78,46.97 AMP.P23 55.73,47.02 56.69,47.02 57.84,45.87 v57.84,41.99
  Bottom 0.254: MOTHALL.P$3 116.2,71.17 115.52,70.48 114.3,70.48 101.88,58.06 95.48,58.06 92.58,55.17 92.58,51.89 82.6,41.91 57.91,41.91 v57.84,41.99
HALL_W  (via drill 0.38)
  Top 0.254: AMP.P24 49.53,46.94 v47.85,46.94
  Bottom 0.254: MOTHALL.P$4 114.2,71.46 101.8,59.05 95.4,59.05 91.82,55.47 91.82,52.5 82.53,43.2 49.91,43.2 47.85,45.26 v47.85,46.94
IMU_!CS
  Top 0.203: CTRL.PD4 6.16,29.66 IC7.P$8
IMU_FSYNC  (via drill 0.38)
  Top 0.203: IC7.P$11 9.67,28.12 8.91,28.12 8.61,27.81 v6.93,27.81
  Bottom 0.203: v6.93,27.81 6.4,27.28 6.4,24.61 5.28,23.5 CTRL.PD0
IMU_INT
  Top 0.203: IC7.P$12 9.26,27.13 4.72,27.13 3.56,26.04 CTRL.PD3
IMU_MISO
  Top 0.203: CTRL.PD6 5.08,30.07 4.04,29.03 4.04,28.04 4.5,27.58 5.71,27.58 7.29,29.16 IC7.P$9
IMU_MOSI  (via drill 0.38)
  Top 0.203: IC7.P$24 13.95,30.39 v13.95,31.47
  Bottom 0.203: v13.95,31.47 13.79,31.32 7.77,31.32 6.1,29.64 4.65,29.64 3.58,28.57 CTRL.PD5
IMU_SCK  (via drill 0.38)
  Top 0.203: IC7.P$23 13.72,29.64 14.4,29.64 14.78,30.02 v14.78,32.16
  Bottom 0.203: v14.78,32.16 3.89,32.16 2.85,31.11 CTRL.PD7
INC_A  (via drill 0.38)
  Top 0.254: v49.61,66.6 50.42,65.78 IC6.15
  Bottom 0.254: CTRL.PH1 3.07,53.98 4.42,55.32 5.33,55.32 10.9,60.88 10.9,63.09 15.24,67.44 48.77,67.44 v49.61,66.6
INC_A+
  Top 0.254: AMP.P27 55.78,52.35 59.89,52.35 59.87,52.32 R1.1 | R1.1 C1.1 | IC6.2 50.42,60.71 51.89,62.18 55.85,62.18 57.07,60.96 63.32,60.88 63.25,56.77 63.25,55.02 61.65,53.42 60.44,53.42 R1.1
INC_A-
  Top 0.254: IC6.1 46.12,59.38 42.14,55.4 42.14,52.5 42.9,51.74 44.36,51.74 R2.1
  Top 0.406: C2.1 R2.1 46.7,52.2 AMP.P28
INC_B  (via drill 0.38)
  Top 0.254: v51.13,66.37 51.13,65.19 IC6.14
  Bottom 0.254: CTRL.PH2 5.08,56.82 8.91,60.66 8.91,62.48 15.09,68.66 48.84,68.66 v51.13,66.37
INC_B+
  Top 0.254: C3.1 R3.1 58.97,54.74 AMP.P29 55.7,54.81 55.7,60.43 54.63,61.49 52.2,61.49 51.07,60.37 IC6.3
INC_B-
  Top 0.254: IC6.4 51.72,56.93 AMP.P30 45.43,54.74 R4.1 43.6,53.16 C4.1
INC_I  (via drill 0.38)
  Top 0.254: v52.96,67.21 53.02,67.15 IC6.11
  Bottom 0.254: CTRL.PH0 10.85,59.74 17.68,59.74 18.75,61.11 18.75,65.23 19.66,66.14 47.47,66.14 48.08,65.53 51.97,65.53 52.96,66.52 v52.96,67.21
INC_I+  (via drill 0.38)
  Top 0.254: AMP.P25 57.95,49.66 C5.1 59.35,47.47 | 59.35,47.47 R5.1 | IC6.6 53.02,58.54 v54.18,57.38 | v64.24,57.38 64.24,48.92 62.64,47.32 59.5,47.32 59.35,47.47
  Bottom 0.254: v64.24,57.38 v54.18,57.38
INC_I-  (via drill 0.38)
  Top 0.254: IC6.5 52.37,57.66 v52.81,57.23 | v48.69,50.75 48.69,49.89 48.92,49.66 | C6.1 46.28,46.74 47.24,47.7 48.92,49.43 49,49.66
  Top 0.406: R6.1 C6.1 | 48.92,49.66 49,49.66 AMP.P26
  Bottom 0.254: v52.81,57.23 51.51,57.23 49.68,55.4 49.68,51.74 v48.69,50.75
LIM1
  Top 0.254: LIM1.P$1 29.21,67.87 31.62,65.46 31.62,62.99 CTRL.PK0
LIM2
  Top 0.254: CTRL.PK1 33.02,67.58 LIM2.P$1
LIM3
  Top 0.254: CTRL.PK2 35.26,61.59 34.06,62.79 34.06,66.29 39.09,71.32 44.38,71.32 LIM3.P$1
LIM4
  Top 0.254: LIM4.P$1 50.86,70.18 40.16,70.18 35.56,65.58 CTRL.PK3
LIM5
  Top 0.254: LIM5.P$1 58.02,69.72 41.15,69.72 36.88,65.46 36.88,62.81 CTRL.PK4
LIM6
  Top 0.254: LIM6.P$1 65.19,69.27 42.67,69.27 38.1,64.69 CTRL.PK5
LIM7
  Top 0.254: CTRL.PK6 39.55,62.69 39.55,65 43.43,68.89 70.41,68.89 72.91,71.39 LIM7.P$1
LIM8
  Top 0.254: CTRL.PK7 45.01,68.5 78.41,68.5 81.3,71.39 LIM8.P$1
LOGIC_SENSE  (via drill 0.38)
  Top 0.254: R31.1 R32.2 58.81,15.7 v56.84,15.7 | v33.91,5.87 30.48,9.3 CTRL.PB1
  Bottom 0.254: v56.84,15.7 55.55,14.4 48.69,14.4 48.62,14.48 35.13,14.48 34.29,13.26 34.29,6.86 34.21,6.55 v33.91,5.87
MOT_U  (via drill 0.64)
  other vias: 107.95,23.5 110.49,23.5 113.03,23.5 102.87,23.5 100.33,23.5 118.11,23.5 120.65,23.5 123.19,23.5 125.73,23.5
  pour Top (isolate 0.381, no thermals): 98.81,25.4 98.81,19.68 133.1,19.68 132.33,25.4
  pour Bottom (isolate 0.381, no thermals): 98.81,25.4 98.81,19.68 133.1,19.68 133.1,25.4
MOT_V  (via drill 0.64)
  other vias: 100.33,28.57 102.87,28.57 107.95,28.57 110.49,28.57 113.03,28.57 118.11,28.57 120.65,28.57 123.19,28.57 125.73,28.57
  pour Top (isolate 0.381, no thermals): 98.81,30.48 133.1,30.48 133.1,26.92 133.1,26.67 98.81,26.67
  pour Bottom (isolate 0.381, no thermals): 98.81,30.48 133.1,30.48 133.1,26.92 133.1,26.67 98.81,26.67
MOT_W  (via drill 0.64)
  other vias: 102.87,33.66 100.33,33.66 107.95,33.66 110.49,33.66 113.03,33.66 118.11,33.66 120.65,33.66 123.19,33.66 125.73,33.66
  pour Top (isolate 0.381, no thermals): 98.81,35.56 133.1,35.56 133.1,31.75 98.81,31.75
  pour Bottom (isolate 0.381, no thermals): 98.81,35.56 133.1,35.56 133.1,31.75 98.81,31.75
N$1  (via drill 0.38)
  Top 0.254: ENCODER.P$2 104.06,66.46 R12.1 | R1.2 62.92,52.32 v63.02,52.43
  Bottom 0.254: v63.02,52.43 81.53,52.43 83.29,54.18 84.28,54.18 101.12,71.02 103.22,71.02 104.06,71.86 ENCODER.P$2
N$2
  Top 0.203: R35.2 22.05,23.39
  Top 0.254: 22.05,23.39 SW1.P$1
N$3  (via drill 0.38)
  Top 0.254: ENCODER.P$3 102.06,66.43 R7.2 | R2.2 43.24,50.44 v42.29,50.44 | v57.99,56.69 57.99,56.77 v59.97,58.75
  Bottom 0.254: v42.29,50.44 43.51,49.23 48.77,49.23 50.52,50.98 56.92,50.98 57.53,51.59 57.53,56.24 v57.99,56.69 | v59.97,58.75 73.76,58.75 90.22,75.21 99.24,75.21 ENCODER.P$3
N$4  (via drill 0.38)
  Top 0.254: ENCODER.P$4 100.06,66.4 R11.1
  Top 0.406: R3.2 61.44,54.36 v62.33,55.24
  Bottom 0.254: v62.33,55.24 81.31,55.24 82.14,56.08 83.75,56.08 ENCODER.P$4
N$5  (via drill 0.38)
  Top 0.254: ENCODER.P$5 98.06,66.4 R8.2 | R4.2 43.6,55.26 v46.63,58.06
  Bottom 0.254: v46.63,58.06 74.6,58.06 90.14,73.84 96.61,73.84 ENCODER.P$5
N$6  (via drill 0.38)
  Top 0.254: ENCODER.P$6 96.06,66.43 R10.1 | R5.2 64.14,46.23 74.14,56.24 v77.11,56.24
  Bottom 0.254: v77.11,56.24 80.39,56.24 83.82,59.66 86.11,59.66 91.29,64.85 91.29,69.19 92.2,70.1 93.88,70.1 95.48,71.7 96.06,71.7 ENCODER.P$6
N$7  (via drill 0.38)
  Top 0.254: ENCODER.P$7 94.06,66.46 R9.2 | R6.2 42.93,44.7 v42.22,45.41
  Bottom 0.254: v42.22,45.41 44.73,45.41 47.85,48.54 55.7,48.54 58.37,51.21 58.37,53.49 61.34,56.46 72.54,56.46 73.23,57.15 79.1,57.15 81.23,59.28 81.23,63.25 89,71.02 92.81,71.02 93.5,71.7 94.06,71.7 ENCODER.P$7
N$8
  Top 0.254: IC1.4 20.23,44.12 C7.2
N$9
  Top 0.254: C7.1 19.54,42.33 19.05,42.82 IC1.2
N$10
  Top 0.254: AMP.P20 49.4,41.91 45.87,41.91 45.47,41.5 R14.1
N$11
  Top 0.254: R13.1 AMP.P18
N$12
  Top 0.254: IC1.6 18.54,45.42 C8.2
N$13
  Top 0.254: IC1.5 19.59,44.77 C8.1
N$14  (via drill 0.38)
  Top 0.254: C9.1 10.43,47.47 v11.35,47.47 | v15.39,46.02 15.39,44.35 15.93,43.51 18.12,43.51 IC1.3
  Bottom 0.254: v11.35,47.47 12.8,46.02 v15.39,46.02
N$15
  Top 0.254: C10.2 16.09,47.08 17.07,46.1 18.13,46.1 IC1.7
N$16
  Top 0.254: RGB.P$4 11.2,7.31 11.2,15.05 R17.2
N$17
  Top 0.254: RGB.P$3 10.67,5.84 10.67,12.42 9.74,13.35 R16.2
N$18
  Top 0.254: RGB.P$2 9.74,4.77 R15.2
N$19
  Top 0.254: SSI1.P$2 79.59,5.96 R23.2 78.11,10.38 IC3.8
N$20
  Top 0.203: 30.79,23.39 SW2.P$1 | R36.2 22.03,25.6
  Top 0.254: 30.79,23.39 28.57,25.6 22.03,25.6
N$22
  Top 0.203: SENSE.P$2 39.62,23.56
  Top 0.254: 39.62,23.56 39.62,26.29 35.43,30.48 35.43,34.43 R33.1
N$23
  Top 0.254: IC3.7 76.83,9.95 R23.1 77.89,5.66 SSI1.P$3
N$24
  Top 0.254: SSI1.P$4 75.78,5.77 R24.1 75.56,9.11 IC3.6
N$25
  Top 0.254: SSI1.P$5 74.08,5.47 R24.2 74.3,9.11 IC3.5
N$26
  Top 0.254: IC4.8 94.83,11.15 R25.2 94.83,5.96 SSI2.P$2
N$27
  Top 0.254: SSI2.P$3 94.98,4.61 93.19,6.4 93.19,8.19 R25.1 93.34,8.47 IC4.7
N$28  (via drill 0.38)
  Top 0.203: IC7.P$10 9.63,28.57 8.08,28.57 v8,28.5 | v7.92,30.33 7.92,30.63
  Top 0.406: C19.1 10.71,32.8 10.1,32.8 7.92,30.63
  Bottom 0.203: v8,28.5 7.92,28.57
  Bottom 0.406: 7.92,28.57 v7.92,30.33
N$29
  Top 0.203: IC7.P$20 13.75,28.19
  Top 0.254: 13.75,28.19 14.4,28.19
  Top 0.406: C20.1 15.3,29.1 14.4,28.19
N$30
  Top 0.254: IC4.6 92.08,9.31 R26.1 91.02,5.77 SSI2.P$4
N$31
  Top 0.254: IC4.5 89.32,9.88 R26.2 89.76,7.81 89.76,5.87 90.98,4.65 SSI2.P$5
N$34
  Top 0.254: SSI3.P$2 111.97,4.05 R27.2 111.97,9.12 IC5.8
N$35
  Top 0.254: SSI3.P$3 110.28,3.87 R27.1 109.73,8.04 IC5.7
N$36
  Top 0.254: SSI3.P$4 107.91,4.12 R28.1 108.46,8.04 IC5.6
N$37
  Top 0.254: IC5.5 106.21,9.12 R28.2 SSI3.P$5
PDI1
  Top 0.254: CTRL.PJ0 20.32,56.19 28.17,48.33 IC2.9
PDI1_5V  (via drill 0.38)
  Top 0.254: IC2.12 34.95,48.33 v34.9,48.39 | v36.2,45.95 36.2,40.69 40.23,36.65 40.23,34.06 40.54,33.68 41,33.22 v42.75,31.62 | v45.49,31.62 47.24,31.62 AMP.P10
  Bottom 0.254: v34.9,48.39 34.9,47.24 v36.2,45.95 | v42.75,31.62 v45.49,31.62
PDI2
  Top 0.254: IC2.8 28.44,48.98 21.79,55.63 21.79,62.33 20.32,63.8 CTRL.PJ1
PDI2_5V  (via drill 0.38)
  Top 0.254: IC2.13 36.74,48.98 37.34,48.39 37.34,40.46 41.3,36.5 v41.3,35.51 | v45.64,35.43 45.64,35.36 47.4,33.6 49.07,33.6 49.45,33.22 54.86,33.22 55.55,32.54 55.55,31.95 AMP.P11
  Bottom 0.254: v41.3,35.51 45.57,35.51 v45.64,35.43
PDI3
  Top 0.254: IC2.7 28.62,49.63 23.32,54.94 23.32,61.14 CTRL.PJ2
PDI3_5V  (via drill 0.38)
  Top 0.254: IC2.14 36.85,49.63 37.87,48.62 37.87,40.69 42.22,36.35 42.22,33.15 v42.14,33.07 | v45.49,33.07 48.34,33.07 AMP.P12
  Bottom 0.254: v42.14,33.07 v45.49,33.07
PDO1
  Top 0.254: IC2.6 28.66,50.28 24.38,54.56 24.38,62.71 22.96,64.14 CTRL.PJ3
PDO1_5V
  Top 0.254: 55.63,27.13 AMP.P7 54.43,25.6 47.09,25.6 43.51,29.18 43.51,36.12 38.41,41.22 38.41,48.84 36.97,50.28 IC2.15
PDO2
  Top 0.254: IC2.5 28.77,50.93 25.6,54.1 25.6,61.39 CTRL.PJ4
PDO2_5V
  Top 0.254: IC2.16 37.16,50.93 38.79,49.3 38.79,41.68 44.12,36.35 44.12,29.95 47.32,26.75 49.48,26.75 AMP.P8
PDO3
  Top 0.254: IC2.4 28.89,51.58 26.44,54.03 26.44,63.32 25.63,64.14 CTRL.PJ5
PDO3_5V
  Top 0.254: IC2.17 37.19,51.58 39.24,49.53 39.24,41.99 42.9,38.33 57.3,38.33 59.36,36.27 59.36,31.24 57.45,29.34 AMP.P9
PWM  (via drill 0.38)
  Top 0.178: v29.03,52.43 29.03,52.27 30.18,52.27 IC2.3
  Bottom 0.178: v29.03,52.43 26.44,49.84 7.32,49.84 1.29,43.81 1.29,16.76 4.19,16.76 CTRL.PC4
PWM_5V
  Top 0.254: AMP.P17 54.36,40.77 41.6,40.77 39.7,42.67 39.7,49.84 37.3,52.23 IC2.18
PWR_SENSE  (via drill 0.38)
  Top 0.254: CTRL.PB0 30.63,13.34 31.77,14.48 38.1,14.48 38.94,15.32 51.97,15.32 v52.12,15.16 | v66.98,29.26 75.21,29.26 88.7,42.75 90.16,42.75 R30.2
  Top 0.406: R30.2 R29.1
  Bottom 0.254: v52.12,15.16 52.88,15.16 v66.98,29.26
RED
  Top 0.254: R15.1 5.71,11.43 CTRL.PC0
RXIN
  Top 0.203: CTRL.PF2 6.25,43.81 8.23,45.8 8.23,47.4 9.3,48.46 11.89,48.46 12.5,47.85 12.5,46.9 IC1.9
SSI1  (via drill 0.38)
  Top 0.178: v69.42,9.22 69.42,9.3 76.12,16 76.12,16.46 76.81,17.14 IC3.2
  Bottom 0.178: v69.42,9.22 65.53,9.22 58.22,1.91 44.12,1.91 42.37,3.66 42.37,4.72 36.2,4.72 34.37,2.9 21.64,2.9 11.89,8.69 11.81,18.9 5.56,18.9 CTRL.PC6
SSI2  (via drill 0.38)
  Top 0.178: v88.77,18.75 88.77,15.24 92.51,15.24 92.66,15.39 92.66,15.85 93.34,16.54 IC4.2
  Bottom 0.178: v88.77,18.75 88.24,19.28 87.78,19.28 76.81,30.25 46.94,30.25 46.1,29.41 34.75,29.41 29.34,34.82 24.84,34.82 16.92,26.9 16.92,22.55 4.72,22.55 4.19,23.09 4.19,25.98 5.03,25.98 CTRL.PD2
SSI3
  Top 0.178: IC5.2 109.73,15.24 109.04,14.55 109.04,14.17 107.59,12.72 88.62,12.72 88.62,9.98 82.68,4.04 82.68,3.5 82.07,2.9 63.17,2.9 63.17,5.03 51.74,16.46 34.75,16.46 34.75,24.38 32.54,26.59 20.95,26.59 20.95,22.63 20.73,22.4 18.36,22.4 18.36,32.38 13.72,37.03 1.6,37.03 1.6,44.12 5.03,47.55 5.03,48.84 CTRL.PF6
THERM1  (via drill 0.38)
  Top 0.178: v61.49,13.95 v66.22,13.95
  Top 0.254: R18.2 122.68,6.94 MOTTHERM.P$1
  Bottom 0.178: v61.49,13.95 46.33,13.95 CTRL.PA1 | v66.22,13.95 76.35,24.08 82.53,24.08 88.7,17.91 111.71,17.91 120.7,8.91 MOTTHERM.P$1
THERM2  (via drill 0.38)
  Top 0.178: v62.56,4.72 58.52,4.72 57.99,4.19 57.99,3.66 57.38,3.05 57.38,2.9 54.56,2.9 53.95,3.5 53.95,10.59 50.6,13.95 50.6,14.25 42.82,14.25 42.29,13.72 42.29,13.34 CTRL.PA2
  Top 0.254: R19.2 124.71,8.87 MOTTHERM.P$3
  Bottom 0.178: v62.56,4.72 65.23,2.06 115.14,2.06 121.84,8.76 121.84,9.83 123.75,9.83 124.66,8.91 MOTTHERM.P$3
THERM3  (via drill 0.38)
  Top 0.178: v35.74,5.94 36.2,5.94 41.07,1.07 131.67,1.07 131.67,9.22 131.06,9.83 128.78,9.83 128.78,8.99 MOTTHERM.P$5
  Top 0.254: R20.2 126.75,6.91 MOTTHERM.P$5
  Bottom 0.178: v35.74,5.94 35.81,5.94 40.62,10.74 CTRL.PA3
TXOUT  (via drill 0.38)
  Top 0.254: v13.64,45.26 13.48,45.42 IC1.11
  Bottom 0.254: CTRL.PF3 2.54,43.84 3.89,45.19 13.56,45.19 v13.64,45.26
V+
  Top 0.406: CTRL.P$1 43.18,20.55 41.68,19.05 41.68,17.68 42.44,16.92 51.93,16.92 LOGIC.P$1 66.04,4.81 R31.2
VDD  (via drill 0.64)
  Top 0.254: R29.2 102.36,41.06 AMP.P2-4B
  other vias: 102.87,41.27 100.33,41.27 107.95,41.27 110.49,41.27 113.03,41.27 118.11,41.27 120.65,41.27 118.11,38.73 120.65,38.73 107.95,38.73 110.49,38.73 113.03,38.73 100.33,38.73 102.87,38.73
  pour Top (isolate 0.381, no thermals): 133.1,36.32 98.81,36.32 98.81,43.18 121.41,43.18 arc90 124.21,40.39 133.1,40.39
  pour Bottom (isolate 0.381, no thermals): 135.89,36.32 135.89,64.01 126.75,64.01 126.75,43.18 98.81,43.18 98.81,36.32 135.64,36.32
VSS  (via drill 0.64)
  other vias: 105.41,52.07 105.41,54.61 110.49,52.07 110.49,54.61 115.57,52.07 115.57,54.61 100.33,54.61 100.33,52.07 100.33,46.35 102.87,46.35 107.95,46.35 110.49,46.35 113.03,46.35 118.11,46.35 120.65,46.35 123.19,46.35
  pour Top (isolate 0.381, no thermals): 133.1,41.15 133.1,56.64 130.56,56.64 130.56,64.01 110.49,64.01 110.49,56.39 98.81,56.39 98.81,44.2 122.17,44.2 122.17,43.94 arc90 124.97,41.15
  pour Bottom (isolate 0.381, no thermals): 98.81,56.39 110.49,56.39 110.49,64.01 125.98,64.01 125.98,44.2 98.81,44.2

### Text on the board
tNames: - | + | V- | V+ | Medulla 2.0 | W | Atrias Motor Interface | V | 12/1/11 btk | U